# EasyEDA Pro project 同轴电缆.eprj, schematic 模拟部分

## Sheets
1 定向电桥: Create Date: 2023-09-01; Page Name: 定向电桥; Project Name: 同轴线缆长度及终端负载检测装置; Schematic Name: 模拟部分; Update Date: 2023-09-01; Company: 嘉立创EDA; Page Size: A4; Version: V1.0
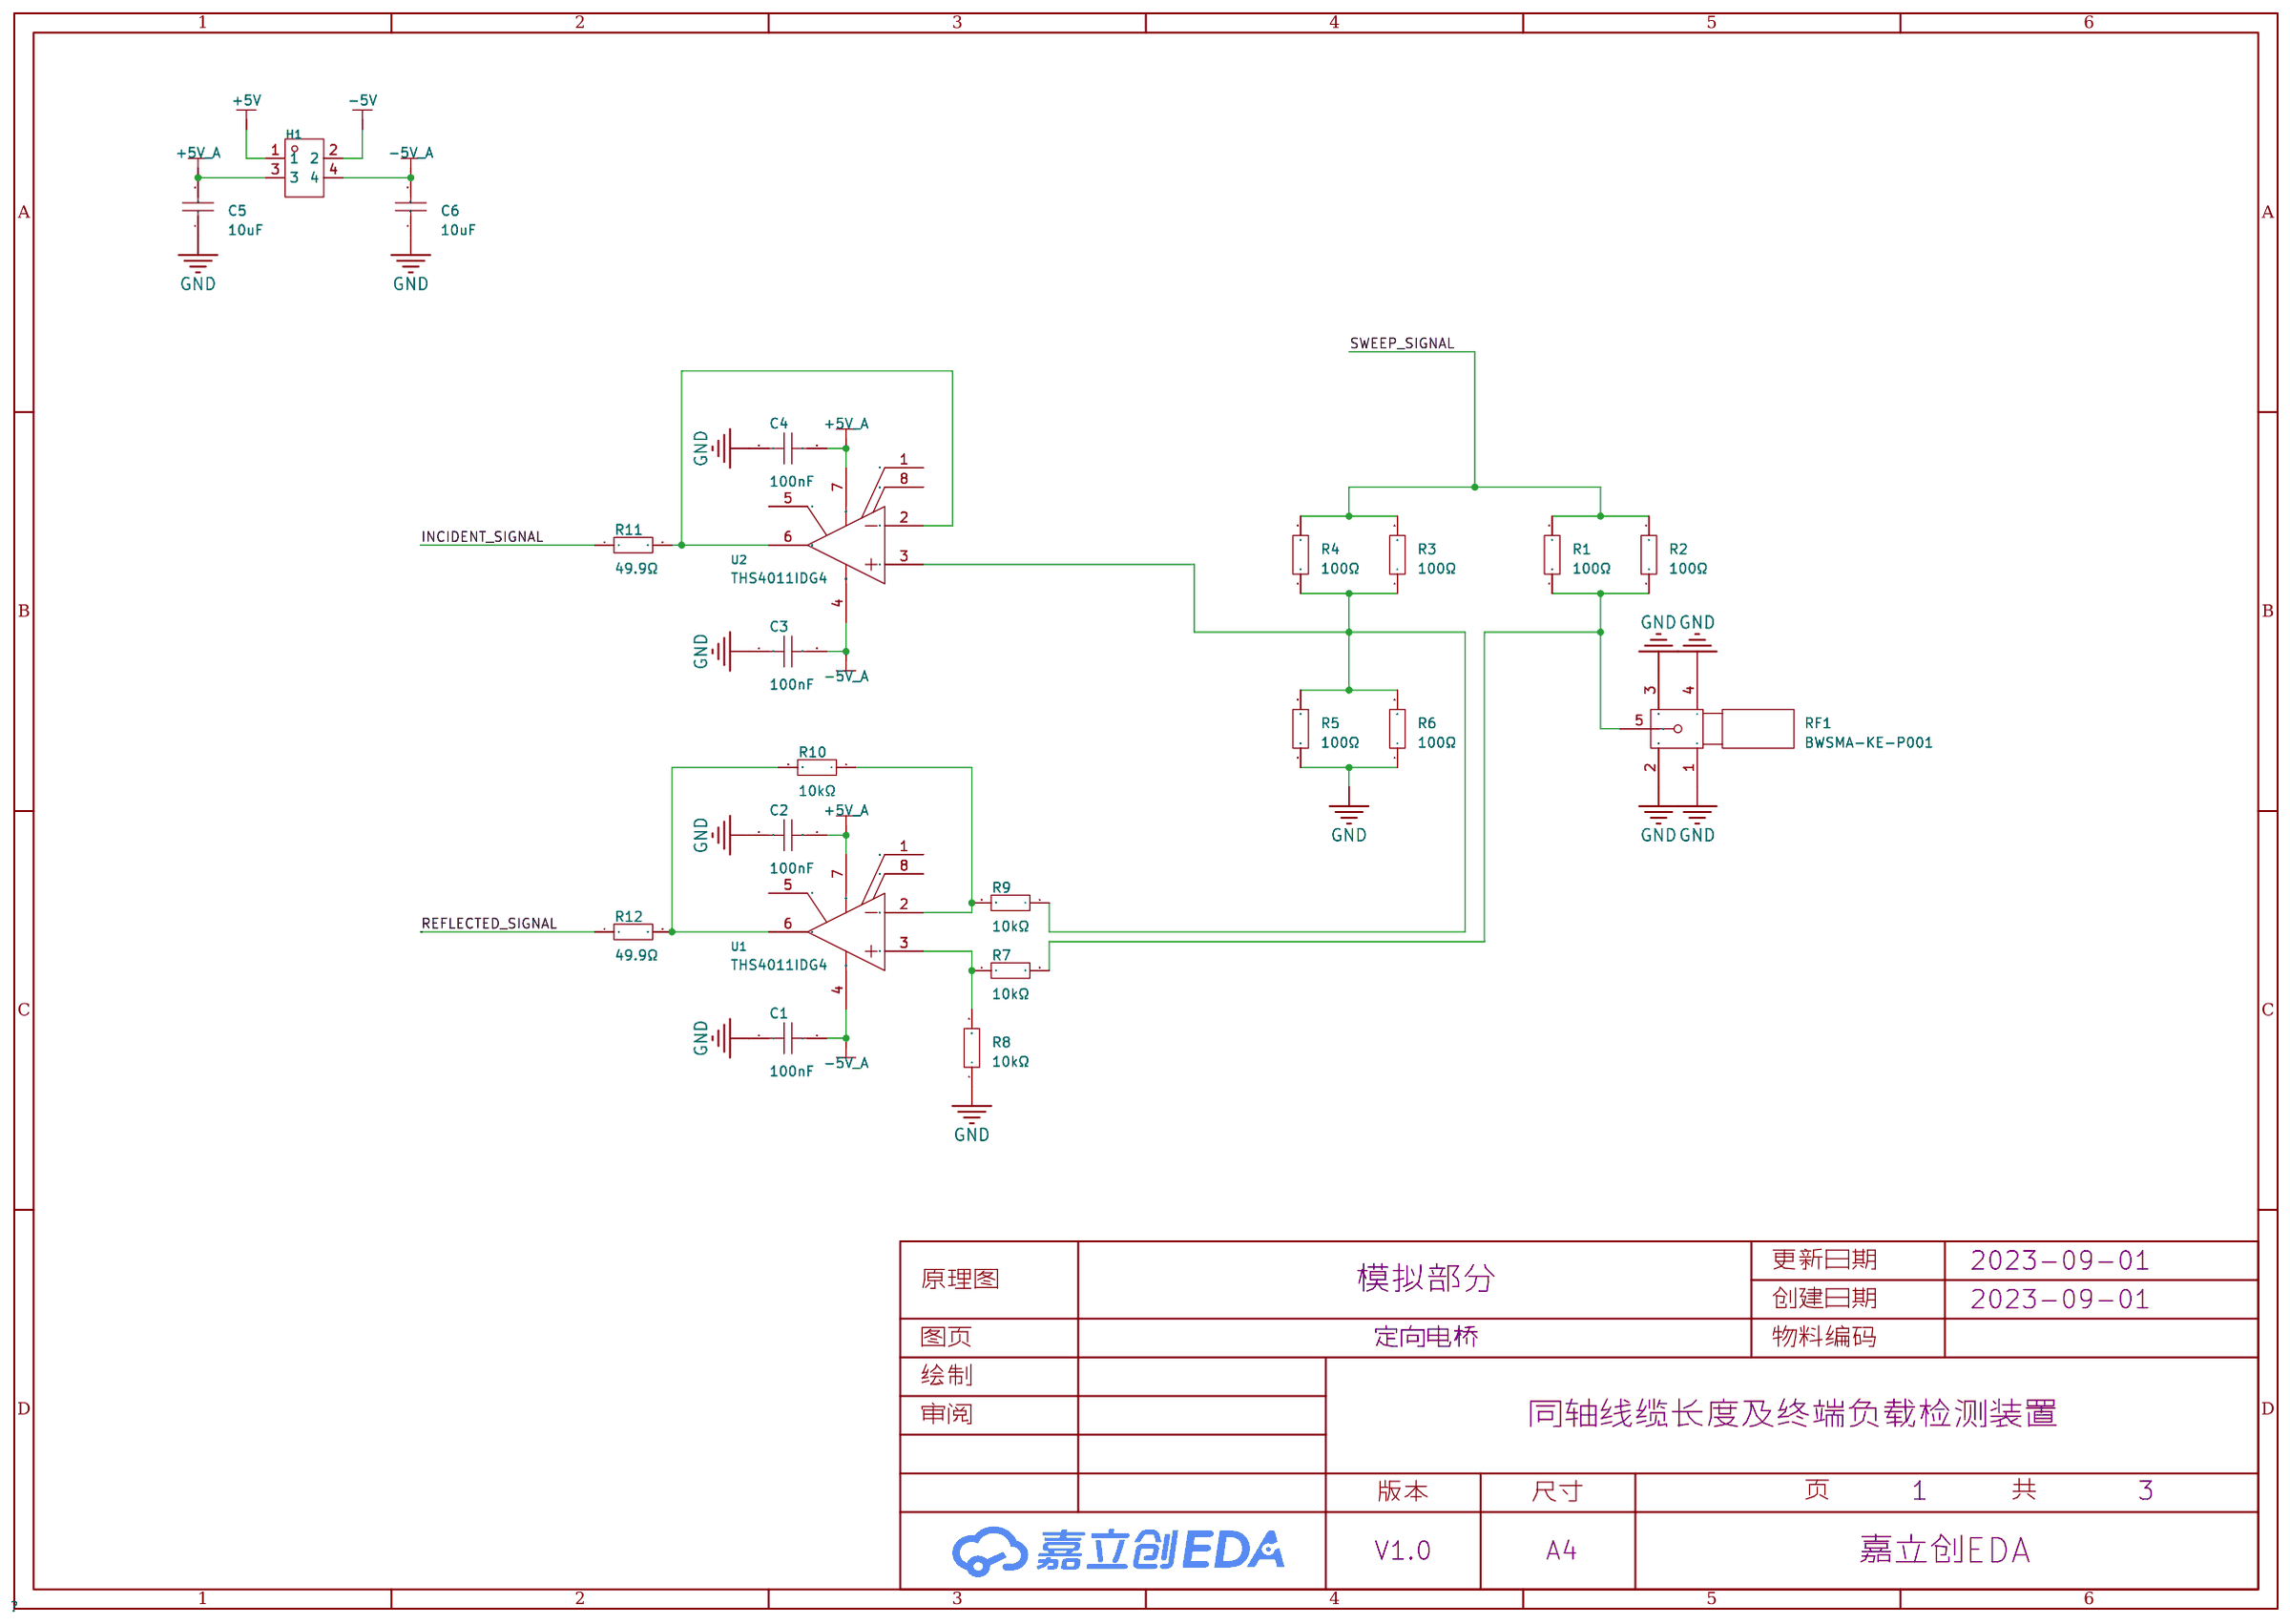
[diagram p0: 定向电桥]
2 混频器: Page Name: 混频器; Project Name: 【2023电赛本科组-TI杯】同轴线缆长度及终端负载检测装置; Update Date: 2023-09-07
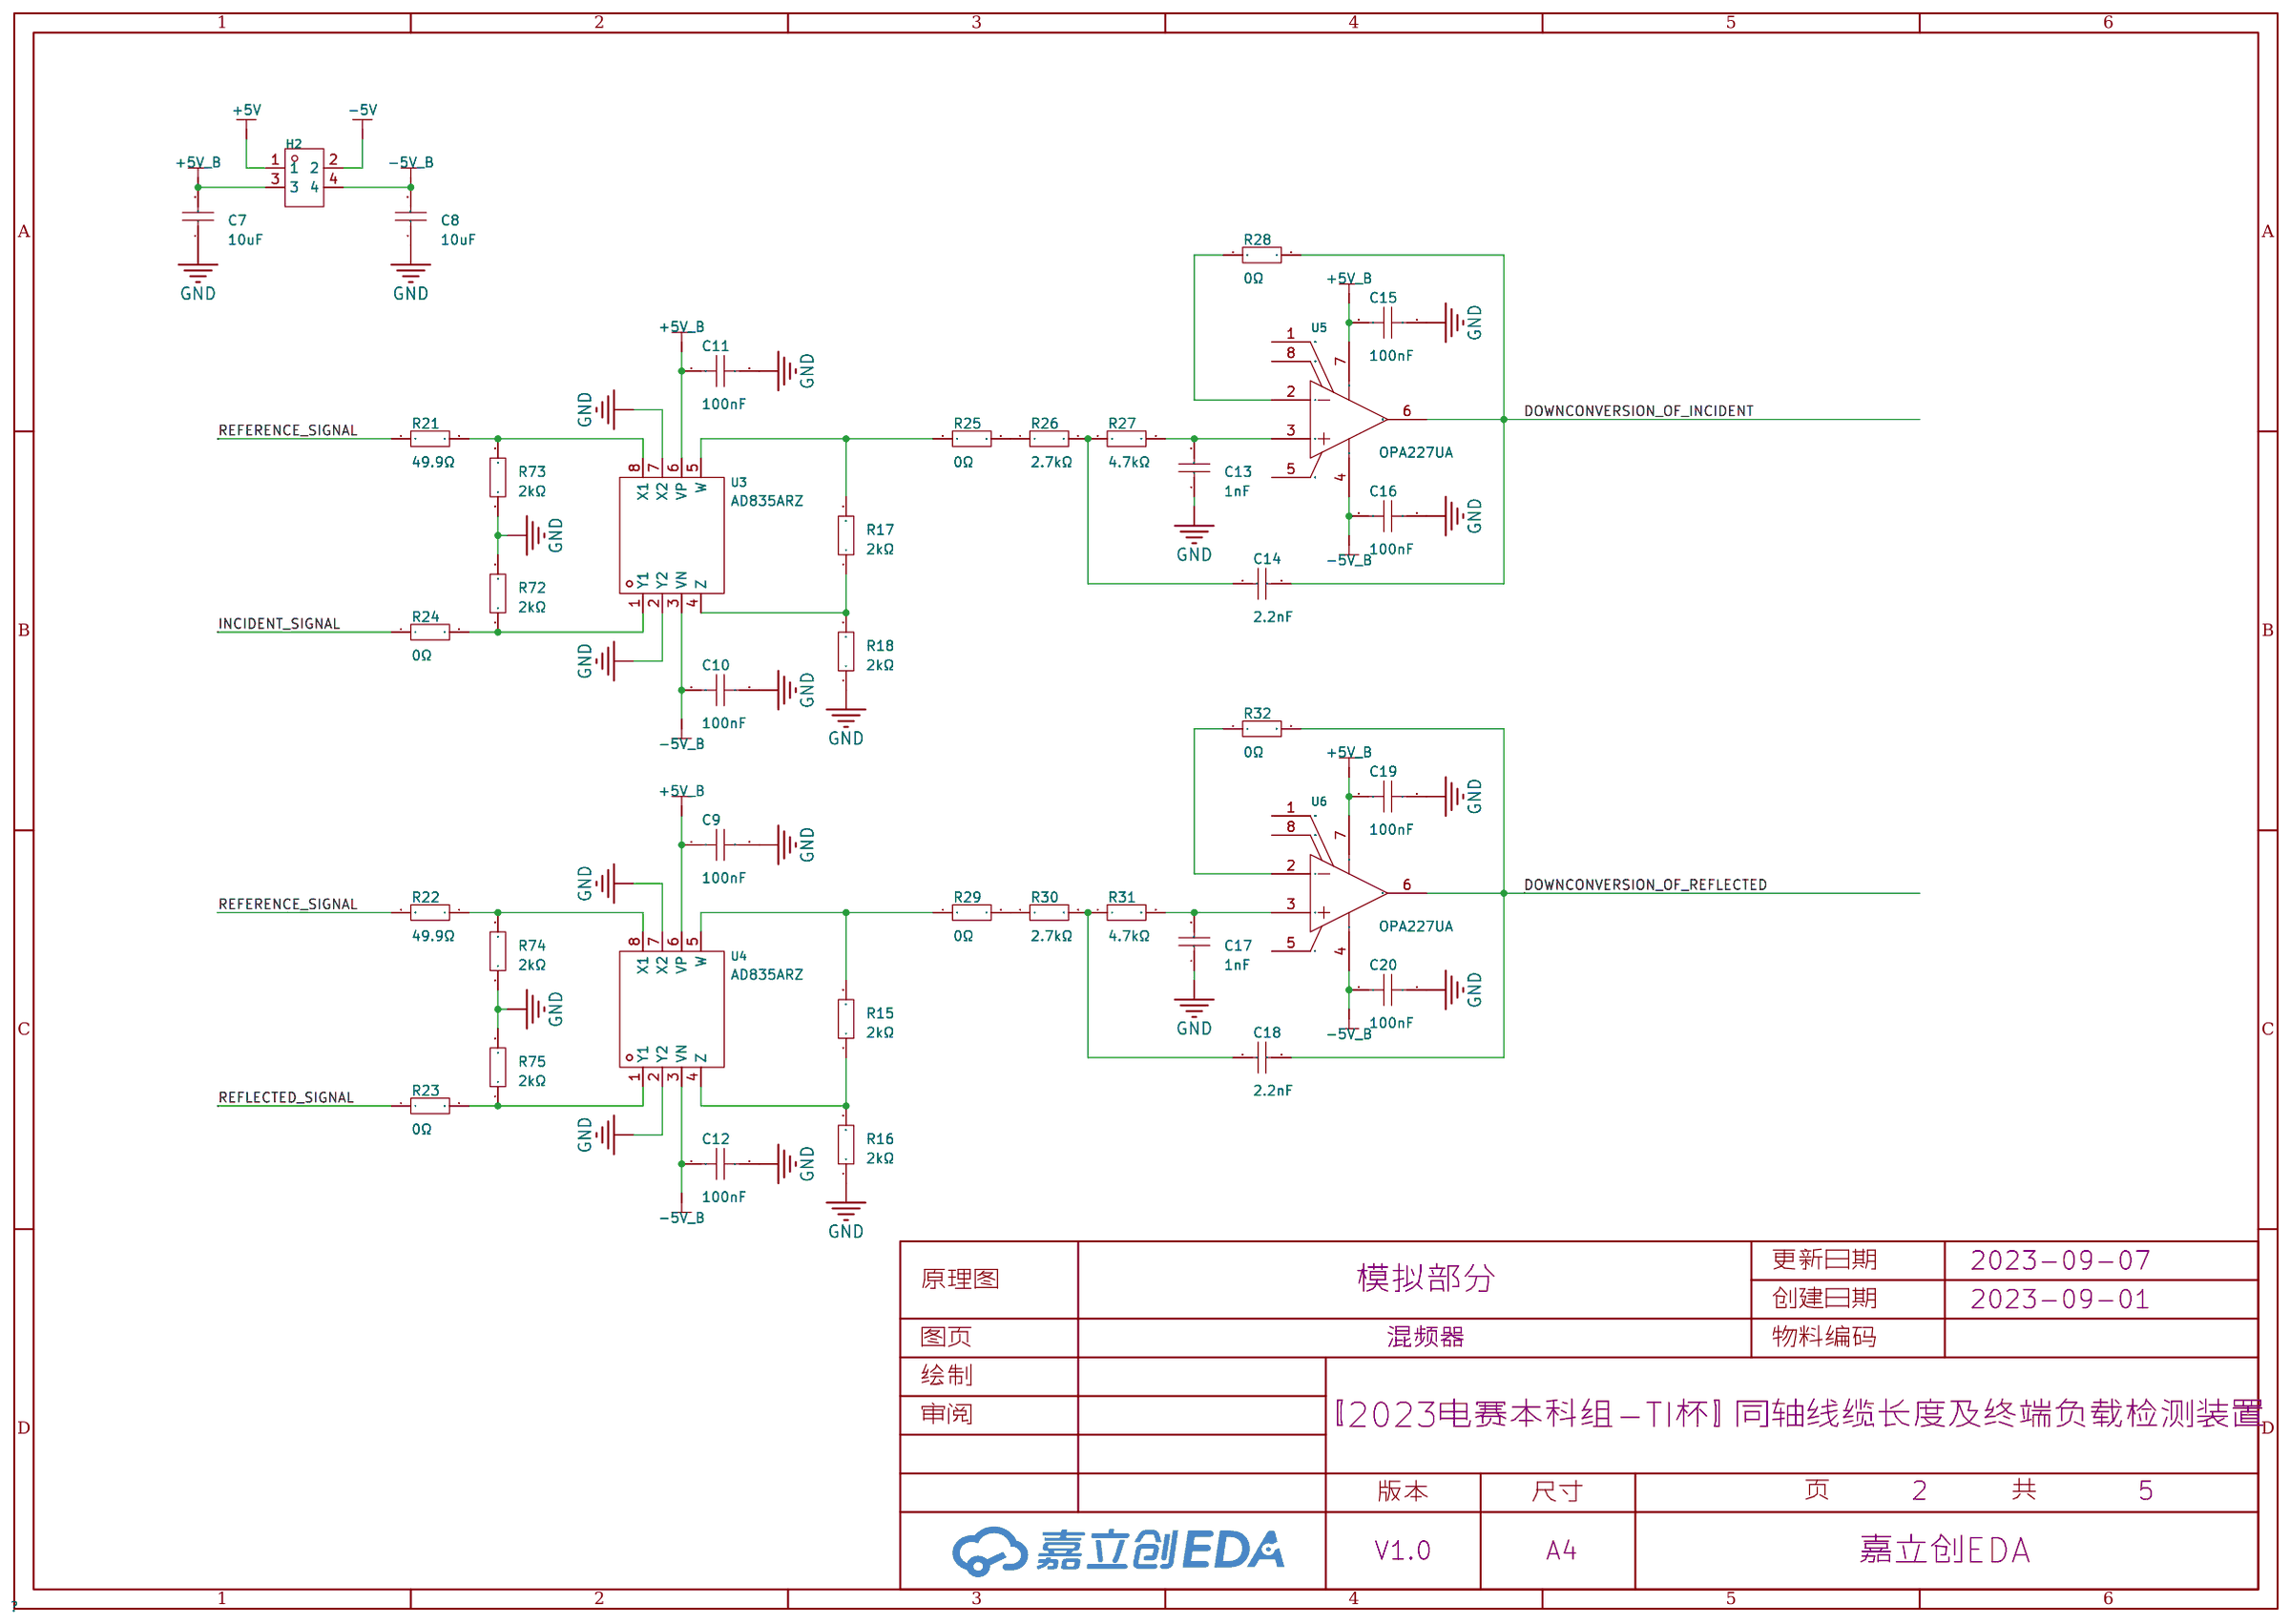
[diagram p1: 混频器]
3 ADC: Page Name: ADC; Update Date: 2023-09-02
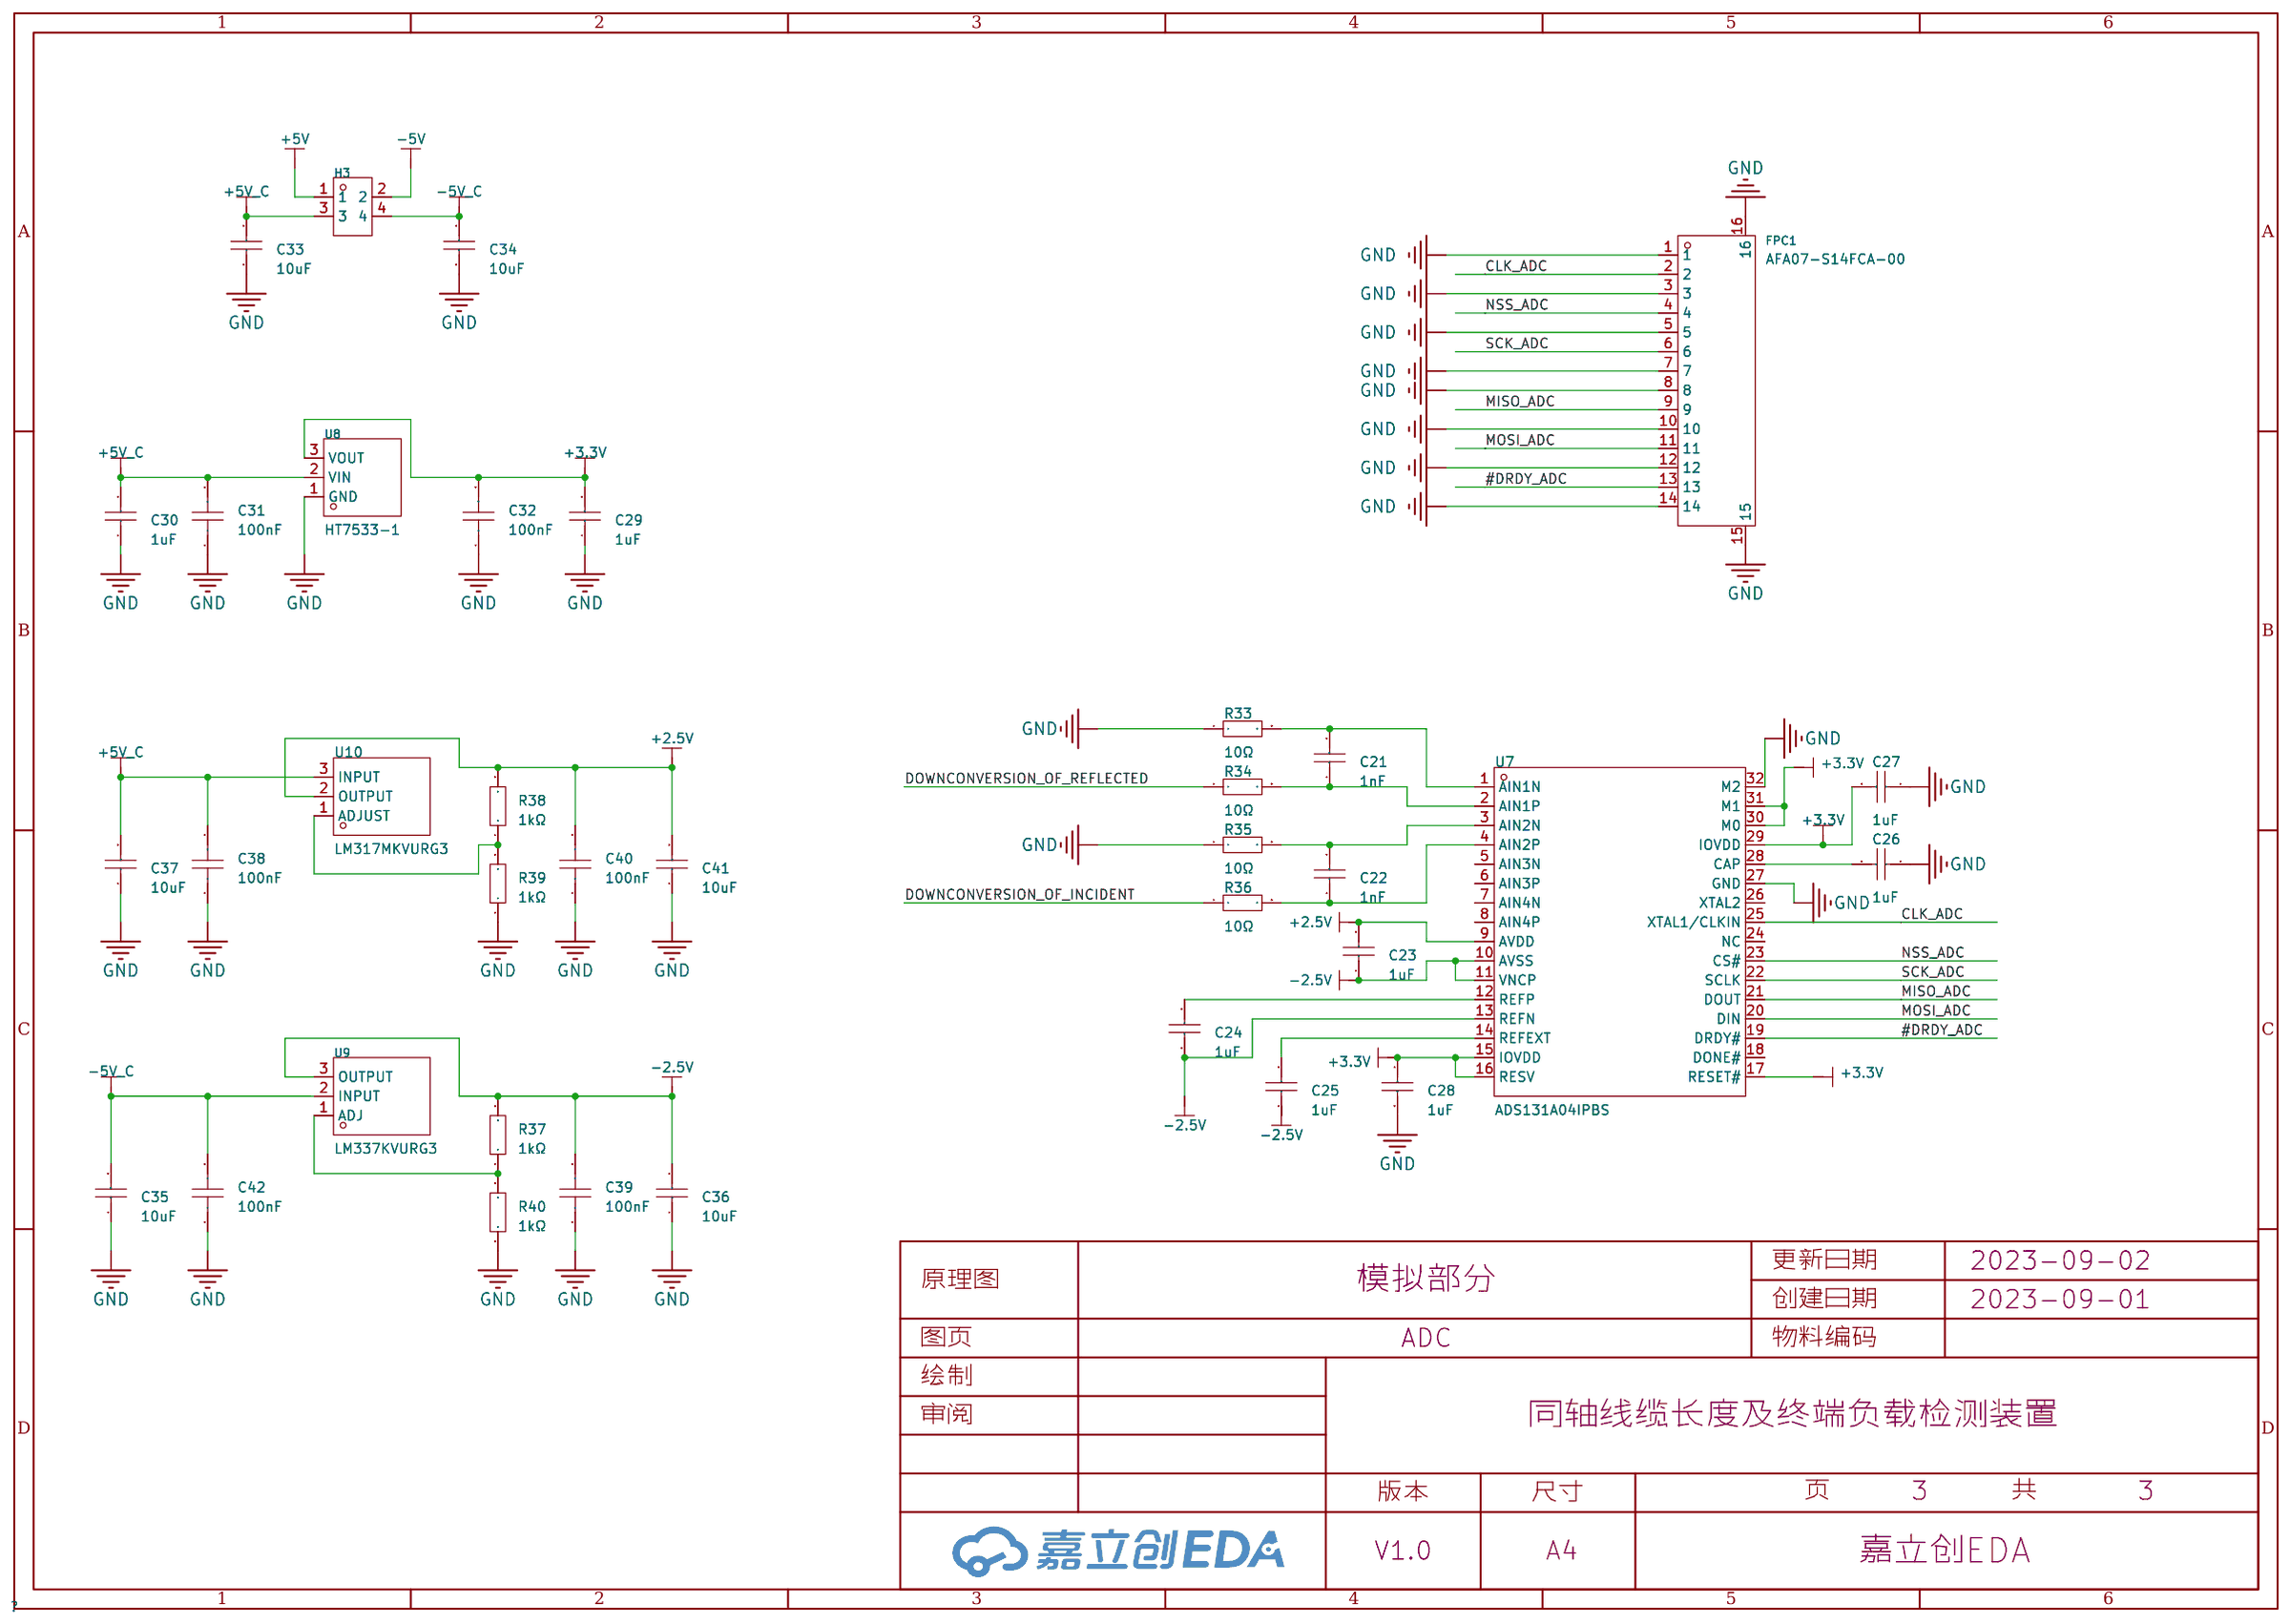
[diagram p2: ADC]
4 DDS: Create Date: 2023-09-02; Page Name: DDS; Project Name: 【2023电赛本科组-TI杯】同轴线缆长度及终端负载检测装置; Update Date: 2023-09-25
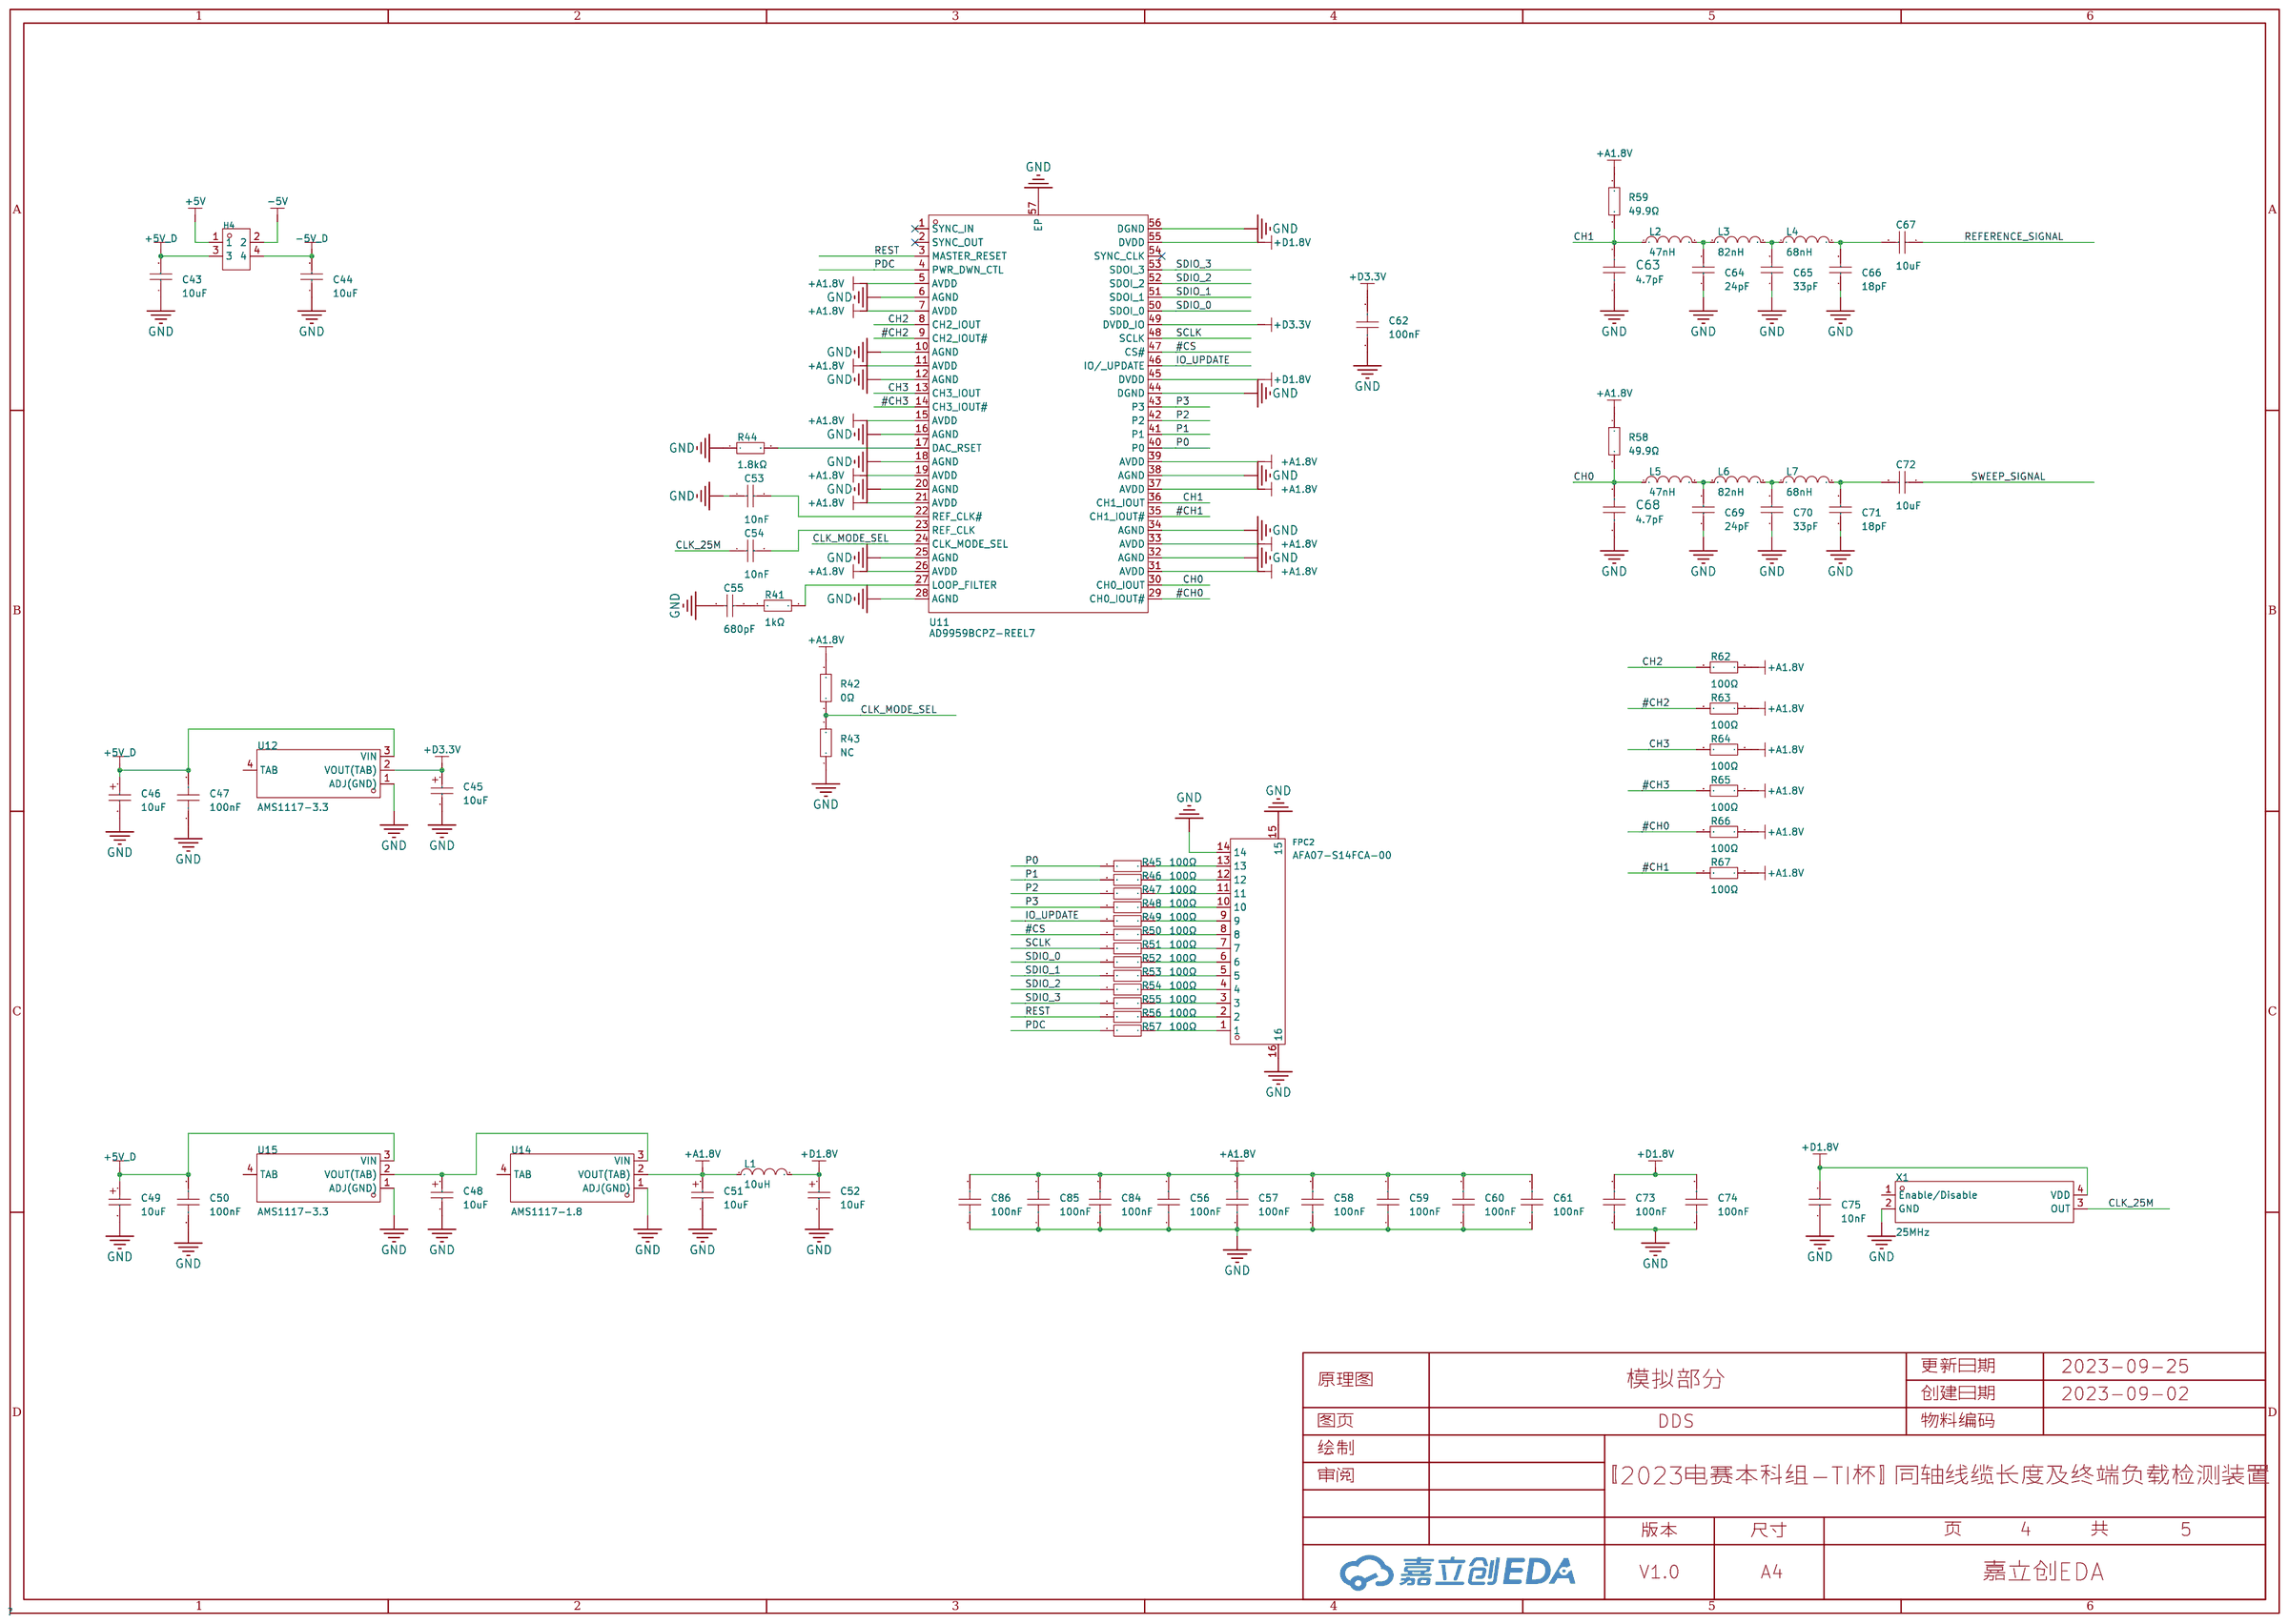
[diagram p3: DDS]
5 电源电路: Create Date: 2023-09-02; Page Name: 电源电路; Update Date: 2023-09-02
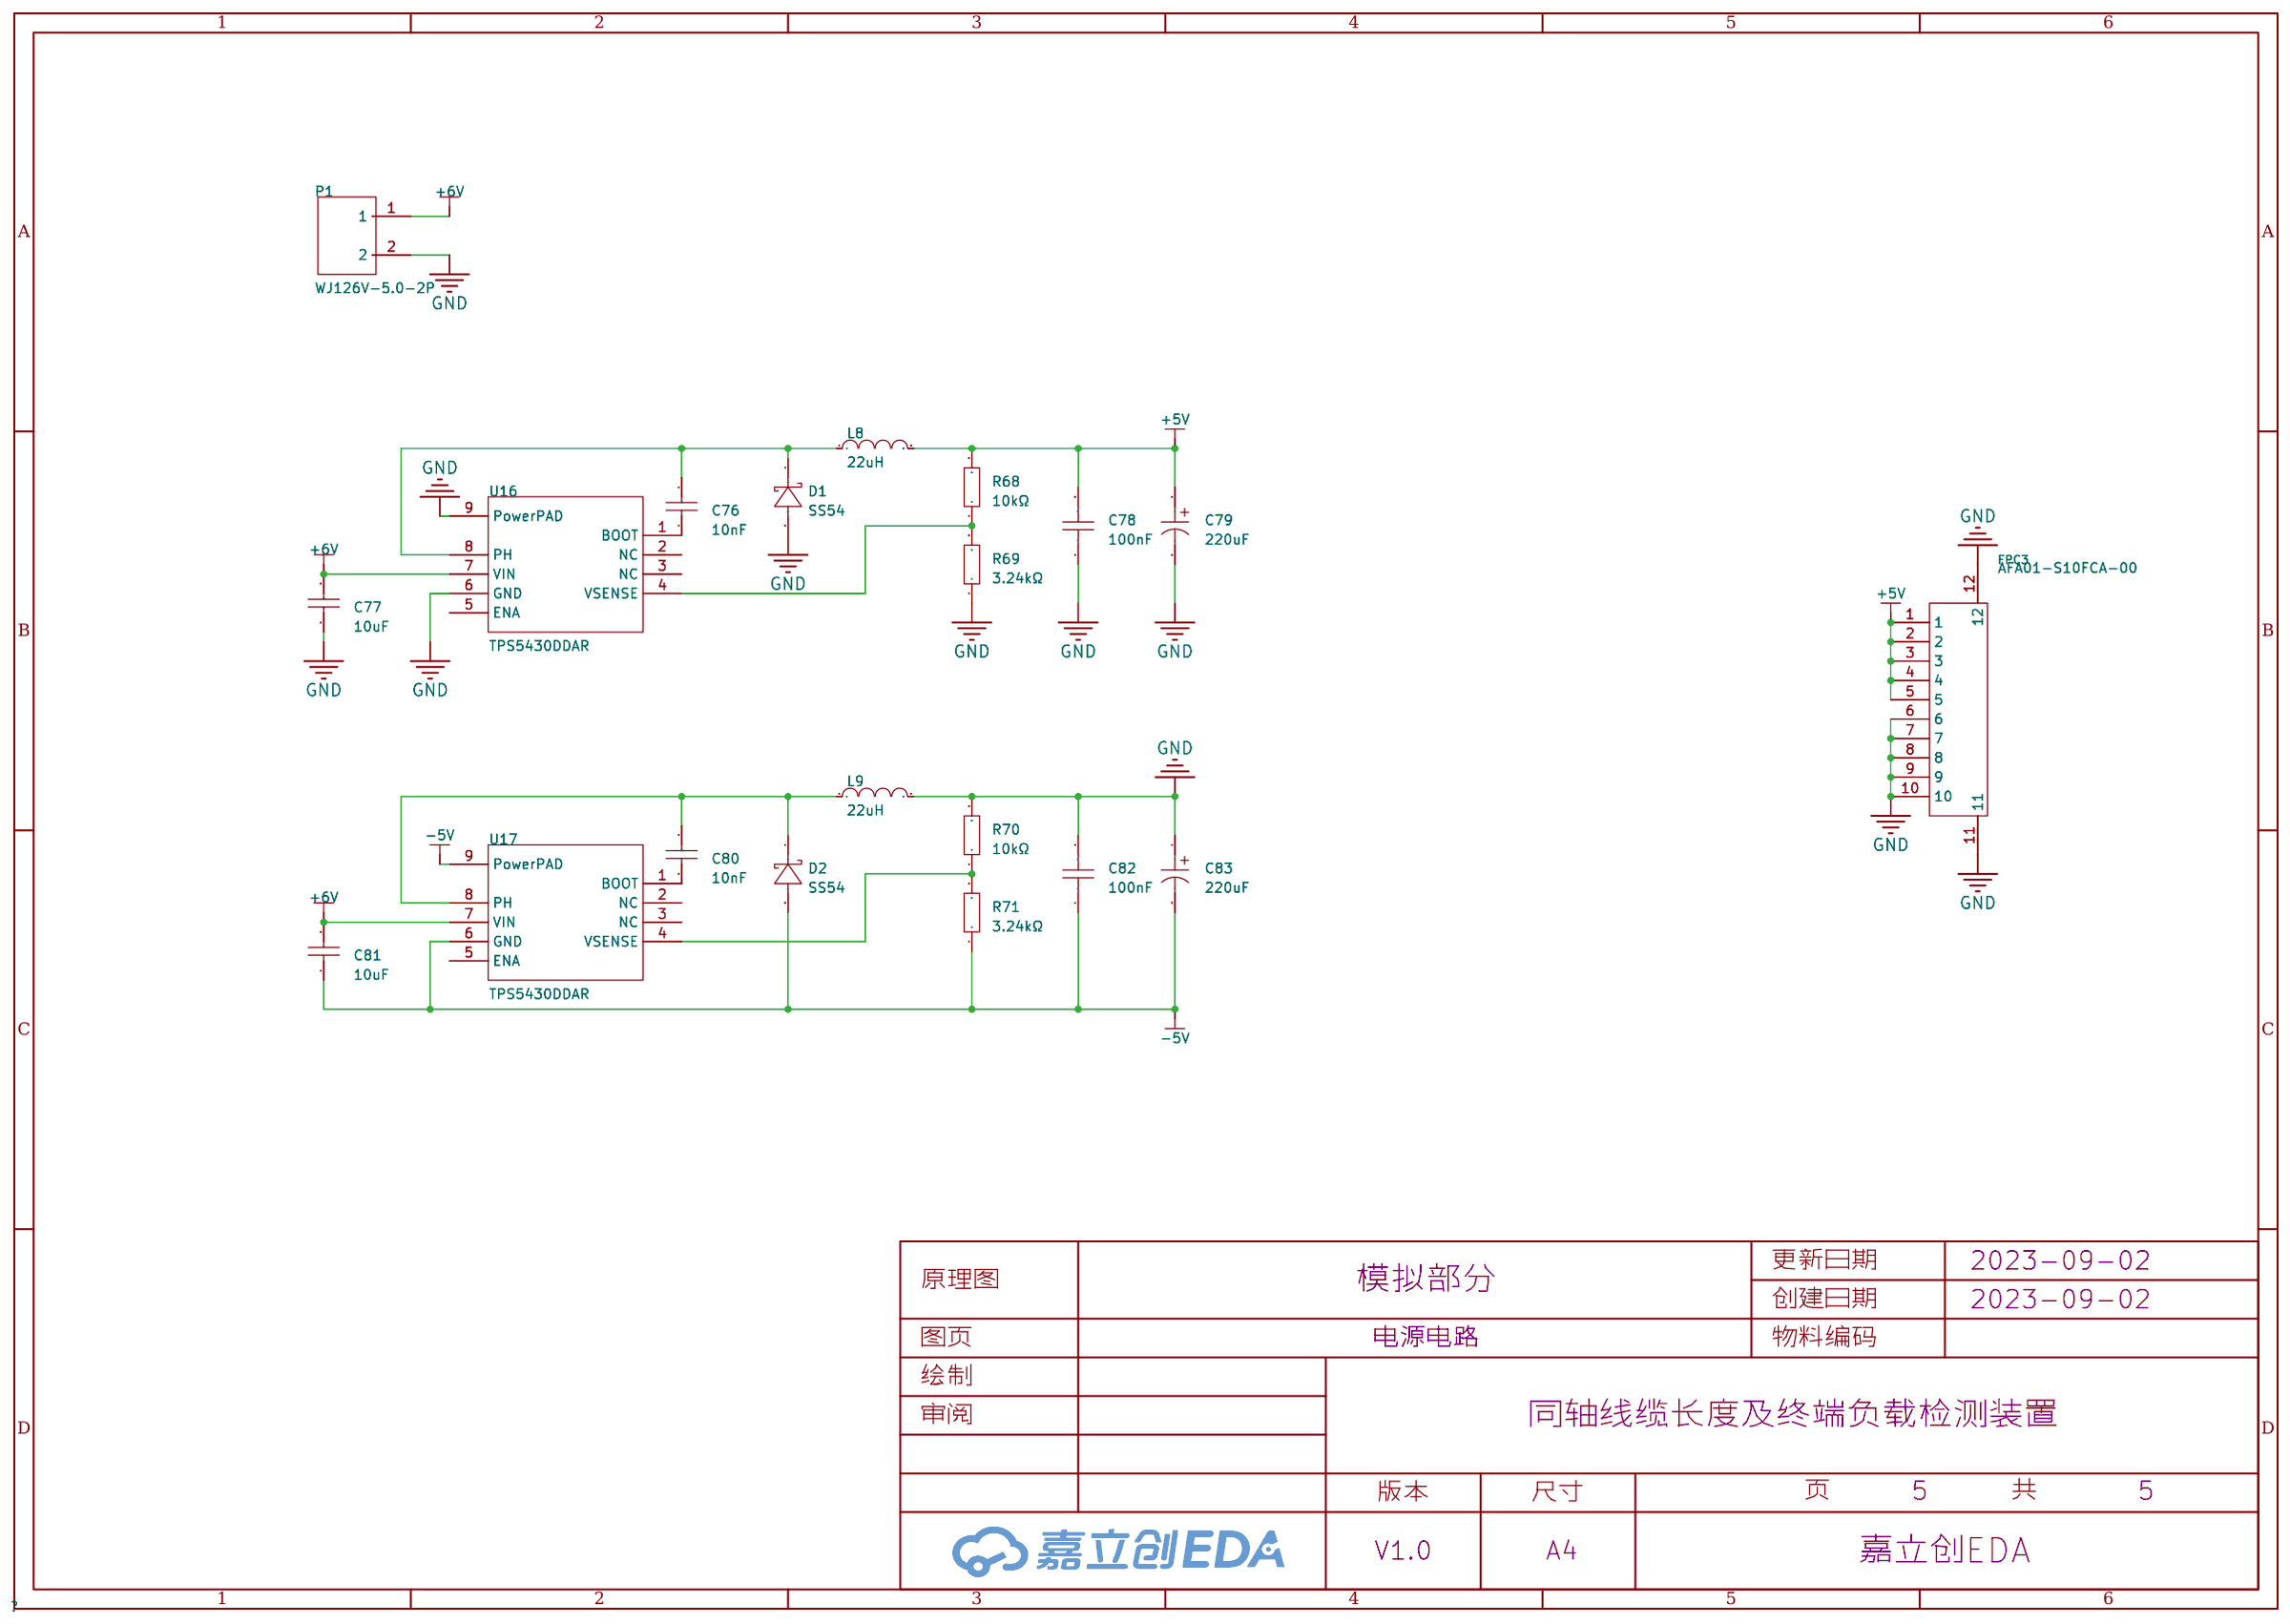
[diagram p4: 电源电路]

## Parts
sheet ADC
C21  1nF  [C0603]
C22  1nF  [C0603]
C23  1uF  [C0603]
C24  1uF  [C0603]
C25  1uF  [C0603]
C26  1uF  [C0603]
C27  1uF  [C0603]
C28  1uF  [C0603]
C29  1uF  [C0603]
C30  1uF  [C0603]
C31  100nF  [C0603]
C32  100nF  [C0603]
C33  10uF  [C0805]
C34  10uF  [C0805]
C35  10uF  [C0805]
C36  10uF  [C0805]
C37  10uF  [C0805]
C38  100nF  [C0603]
C39  100nF  [C0603]
C40  100nF  [C0603]
C41  10uF  [C0805]
C42  100nF  [C0603]
FPC1  AFA07-S14FCA-00  [FPC-SMD_P1.00-14P_LCS-XJ-H2.5]
H3  PZ254V-12-4P  [HDR-TH_4P-P2.54-V-M-R2-C2-S2.54]
R33  10Ω  [R0603]
R34  10Ω  [R0603]
R35  10Ω  [R0603]
R36  10Ω  [R0603]
R37  1kΩ  [R0603]
R38  1kΩ  [R0603]
R39  1kΩ  [R0603]
R40  1kΩ  [R0603]
U7  ADS131A04IPBS  [TQFP-32_L5.0-W5.0-P0.50-LS7.0-BL]
U8  HT7533-1  [SOT-89_L4.5-W2.5-P1.50-LS4.2-BR]
U9  LM337KVURG3  [DPAK-3_L6.6-W6.1-P2.28-LS9.9-BR]
U10  LM317MKVURG3  [TO-252-3_L6.5-W6.1-P4.58-TL]
sheet DDS
C43  10uF  [C0805]
C44  10uF  [C0805]
C45  10uF  [CAP-SMD_L3.2-W1.6-RD-C7171]
C46  10uF  [CAP-SMD_L3.2-W1.6-RD-C7171]
C47  100nF  [C0603]
C48  10uF  [CAP-SMD_L3.2-W1.6-RD-C7171]
C49  10uF  [CAP-SMD_L3.2-W1.6-RD-C7171]
C50  100nF  [C0603]
C51  10uF  [CAP-SMD_L3.2-W1.6-RD-C7171]
C52  10uF  [CAP-SMD_L3.2-W1.6-RD-C7171]
C53  10nF  [C0603]
C54  10nF  [C0603]
C55  680pF  [C0603]
C56  100nF  [C0603]
C57  100nF  [C0603]
C58  100nF  [C0603]
C59  100nF  [C0603]
C60  100nF  [C0603]
C61  100nF  [C0603]
C62  100nF  [C0603]
C63  4.7pF  [C0603]
C64  24pF  [C0603]
C65  33pF  [C0603]
C66  18pF  [C0603]
C67  10uF  [C0805]
C68  4.7pF  [C0603]
C69  24pF  [C0603]
C70  33pF  [C0603]
C71  18pF  [C0603]
C72  10uF  [C0805]
C73  100nF  [C0603]
C74  100nF  [C0603]
C75  10nF  [C0603]
C84  100nF  [C0603]
C85  100nF  [C0603]
C86  100nF  [C0603]
FPC2  AFA07-S14FCA-00  [FPC-SMD_P1.00-14P_LCS-XJ-H2.5]
H4  PZ254V-12-4P  [HDR-TH_4P-P2.54-V-M-R2-C2-S2.54]
L1  10uH  [L1210]
L2  47nH  [L0603]
L3  82nH  [L0603]
L4  68nH  [L0603]
L5  47nH  [L0603]
L6  82nH  [L0603]
L7  68nH  [L0603]
R41  1kΩ  [R0603]
R42  0Ω  [R0603]
R43  NC  [R0603]
R44  1.8kΩ  [R0603]
R45  100Ω  [R0603]
R46  100Ω  [R0603]
R47  100Ω  [R0603]
R48  100Ω  [R0603]
R49  100Ω  [R0603]
R50  100Ω  [R0603]
R51  100Ω  [R0603]
R52  100Ω  [R0603]
R53  100Ω  [R0603]
R54  100Ω  [R0603]
R55  100Ω  [R0603]
R56  100Ω  [R0603]
R57  100Ω  [R0603]
R58  49.9Ω  [R0603]
R59  49.9Ω  [R0603]
R62  100Ω  [R0603]
R63  100Ω  [R0603]
R64  100Ω  [R0603]
R65  100Ω  [R0603]
R66  100Ω  [R0603]
R67  100Ω  [R0603]
U11  AD9959BCPZ-REEL7  [LFCSP-56_L8.0-W8.0-P0.50-BL-EP]
U12  AMS1117-3.3  [SOT-223-4_L6.5-W3.5-P2.30-LS7.0-BR]
U14  AMS1117-1.8  [SOT-223_L6.7-W3.5-P2.30-BR]
U15  AMS1117-3.3  [SOT-223-4_L6.5-W3.5-P2.30-LS7.0-BR]
X1  25MHz  [OSC-SMD_4P-L3.2-W2.5-BL]
sheet 定向电桥
C1  100nF  [C0603]
C2  100nF  [C0603]
C3  100nF  [C0603]
C4  100nF  [C0603]
C5  10uF  [C0805]
C6  10uF  [C0805]
H1  PZ254V-12-4P  [HDR-TH_4P-P2.54-V-M-R2-C2-S2.54]
R1  100Ω  [R0603]
R2  100Ω  [R0603]
R3  100Ω  [R0603]
R4  100Ω  [R0603]
R5  100Ω  [R0603]
R6  100Ω  [R0603]
R7  10kΩ  [R0603]
R8  10kΩ  [R0603]
R9  10kΩ  [R0603]
R10  10kΩ  [R0603]
R11  49.9Ω  [R0603]
R12  49.9Ω  [R0603]
RF1  BWSMA-KE-P001  [SMA-SMD_BWSMA-KE-P001]
U1  THS4011IDG4  [SOIC-8_L4.9-W3.9-P1.27-LS6.0-BL]
U2  THS4011IDG4  [SOIC-8_L4.9-W3.9-P1.27-LS6.0-BL]
sheet 混频器
C7  10uF  [C0805]
C8  10uF  [C0805]
C9  100nF  [C0603]
C10  100nF  [C0603]
C11  100nF  [C0603]
C12  100nF  [C0603]
C13  1nF  [C0603]
C14  2.2nF  [C0603]
C15  100nF  [C0603]
C16  100nF  [C0603]
C17  1nF  [C0603]
C18  2.2nF  [C0603]
C19  100nF  [C0603]
C20  100nF  [C0603]
H2  PZ254V-12-4P  [HDR-TH_4P-P2.54-V-M-R2-C2-S2.54]
R15  2kΩ  [R0603]
R16  2kΩ  [R0603]
R17  2kΩ  [R0603]
R18  2kΩ  [R0603]
R21  49.9Ω  [R0603]
R22  49.9Ω  [R0603]
R23  0Ω  [R0603]
R24  0Ω  [R0603]
R25  0Ω  [R0603]
R26  2.7kΩ  [R0603]
R27  4.7kΩ  [R0603]
R28  0Ω  [R0603]
R29  0Ω  [R0603]
R30  2.7kΩ  [R0603]
R31  4.7kΩ  [R0603]
R32  0Ω  [R0603]
R72  2kΩ  [R0603]
R73  2kΩ  [R0603]
R74  2kΩ  [R0603]
R75  2kΩ  [R0603]
U3  AD835ARZ  [SOIC-8_L4.9-W3.9-P1.27-LS6.0-TL]
U4  AD835ARZ  [SOIC-8_L4.9-W3.9-P1.27-LS6.0-TL]
U5  OPA227UA  [SOIC-8_L4.9-W3.9-P1.27-LS6.0-BL]
U6  OPA227UA  [SOIC-8_L4.9-W3.9-P1.27-LS6.0-BL]
sheet 电源电路
C76  10nF  [C0603]
C77  10uF  [C0805]
C78  100nF  [C0603]
C79  220uF  [CAP-TH_BD6.3-P2.50-D0.6-FD-1]
C80  10nF  [C0603]
C81  10uF  [C0805]
C82  100nF  [C0603]
C83  220uF  [CAP-TH_BD6.3-P2.50-D0.6-FD-1]
D1  SS54  [SMA_L4.3-W2.6-LS5.0-RD]
D2  SS54  [SMA_L4.3-W2.6-LS5.0-RD]
FPC3  AFA01-S10FCA-00  [FPC-SMD_10P-P1.0_FGS-XJ-H2.0]
L8  22uH  [IND-SMD_L7.1-W6.6_SLO0618H]
L9  22uH  [IND-SMD_L7.1-W6.6_SLO0618H]
P1  WJ126V-5.0-2P  [CONN-TH_WJ126V-5.0-2P]
R68  10kΩ  [R0603]
R69  3.24kΩ  [R0603]
R70  10kΩ  [R0603]
R71  3.24kΩ  [R0603]
U16  TPS5430DDAR  [ESOP-8_L4.9-W3.9-P1.27-LS6.0-TL-EP]
U17  TPS5430DDAR  [ESOP-8_L4.9-W3.9-P1.27-LS6.0-TL-EP]

## Library data of the parts
C13 C17 C21 C22 = CC0603KRX7R9BB102: 容值:1nF;精度:±10%;额定电压:50V;材质(温度系数):X7R;; LCSC Part Name: 1nF ±10% 50V; Supplier Part: C100040; Manufacturer: YAGEO(国巨); Supplier Footprint: 0603; JLCPCB Part Class: 扩展库; Datasheet: https://atta.szlcsc.com/upload/public/pdf/source/20170420/1492670664651.pdf; Supplier: LCSC; Tolerance: ±10%; Voltage Rated: 50V; Temperature Coefficient: X7R
C23-C30 = CC0603KRX5R8BB105: 容值:1uF;精度:±10%;额定电压:25V;材质(温度系数):X5R;; LCSC Part Name: 1uF ±10% 25V; Supplier Part: C14664; Manufacturer: YAGEO(国巨); Supplier Footprint: 0603; JLCPCB Part Class: 扩展库; Datasheet: https://atta.szlcsc.com/upload/public/pdf/source/20160606/1465200209684.pdf; Supplier: LCSC; Tolerance: ±10%; Voltage Rated: 25V; Temperature Coefficient: X5R
C1-C4 C9-C12 C15 C16 C19 C20 C31 C32 C38-C40 C42 C47 C50 C56-C62 C73 C74 C78 C82 C84-C86 = CC0603KRX7R9BB104: 容值:100nF;精度:±10%;额定电压:50V;材质(温度系数):X7R;; LCSC Part Name: 100nF ±10% 50V; Supplier Part: C14663; Manufacturer: YAGEO(国巨); Supplier Footprint: 0603; Datasheet: https://atta.szlcsc.com/upload/public/pdf/source/20180910/C282072_33301C7F631E79921B82A8DAC6BCC5B3.pdf; Supplier: LCSC; Tolerance: ±10%; Voltage Rated: 50V; Temperature Coefficient: X7R
C5-C8 C33-C37 C41 C43 C44 C67 C72 C77 C81 = CC0805KKX5R8BB106_C89831: 容值:10uF;精度:±10%;额定电压:25V;材质(温度系数):X5R;; LCSC Part Name: 10uF ±10% 25V; Supplier Part: C89831; Manufacturer: YAGEO(国巨); Manufacturer Part: CC0805KKX5R8BB106; Supplier Footprint: 0805; Datasheet: https://atta.szlcsc.com/upload/public/pdf/source/20170424/1493023836811.pdf; Supplier: LCSC; Tolerance: ±10%; Voltage Rated: 25V; Temperature Coefficient: X5R
FPC1 FPC2 = AFA07-S14FCA-00: 间距:1mm;触点数量:14P;锁定特性:抽屉式;安装类型:卧贴;触点类型:下接;; LCSC Part Name: 1mm P数:14P 抽屉式 下接; Supplier Part: C262720; Manufacturer: JS(钜硕电子); Supplier Footprint: SMD,P=1mm; JLCPCB Part Class: 扩展库; Datasheet: https://atta.szlcsc.com/upload/public/pdf/source/20191217/C262716_30B15E9A77BFCA4A54741C92DB3BE8CC.pdf; Supplier: LCSC; Pitch: 1mm; Number of Contacts: 14P; Locking Feature: 抽屉式; Mounting Type: 卧贴; Contact Type: 下接; Height Above Board: 2.5mm; FFC, FCB Thickness: 0.3mm
H1-H4 = PZ254V-12-4P: 排数:双排;总PIN位数:4;间距:2.54mm;插针结构:2x2P;行距:2.54mm;安装类型:直插;圆针/方针:方针;额定电流:-;额定电压:-;配合针长度:6mm;塑高:2.5mm;端接针长度:3mm;触头材质:黄铜;触头镀层:-;工作温度范围:-40℃~+105℃;颜色:黑色;; LCSC Part Name: 2.54mm 2x2P 直插 方针; Supplier Part: C492419; Manufacturer: XFCN(兴飞); Supplier Footprint: 直插,P=2.54mm; Supplier: LCSC; Number of Rows: 双排; Number of Pins: 4; Pitch: 2.54mm; Pin Structure: 2x2P; Row Spacing: 2.54mm; Mounting Type: 直插; Circluar Pins/Square Pins: 方针; Length of Mating Pin: 6mm; Insulation Height: 2.5mm; Length of End Connection Pin: 3mm; Contact Material: 黄铜; Operating Temperature Range: -40℃~+105℃; Color: 黑色
R33-R36 = 0603WAF100JT5E: 电阻类型:厚膜电阻;阻值:10Ω;精度:±1%;功率:100mW;; LCSC Part Name: 10Ω ±1% 100mW; Supplier Part: C22859; Manufacturer: UNI-ROYAL(厚声); Supplier Footprint: 0603; JLCPCB Part Class: 基础库; Datasheet: https://atta.szlcsc.com/upload/public/pdf/source/20200306/C422600_1E6D84923E4A46A82E41ADD87F860B5C.pdf; Supplier: LCSC; Type: 厚膜电阻; Tolerance: ±1%; Power(Watts): 100mW; Temperature Coefficient: ±400ppm/℃; Overload Voltage (Max): 75V; Operating Temperature Range: -55℃~+155℃
R37-R40 = RT0603BRD071KL: 电阻类型:薄膜电阻;阻值:1kΩ;精度:±0.1%;功率:100mW;; LCSC Part Name: 1kΩ ±0.1% 100mW; Supplier Part: C110776; Manufacturer: YAGEO(国巨); Supplier Footprint: 0603; JLCPCB Part Class: 扩展库; Datasheet: https://atta.szlcsc.com/upload/public/pdf/source/20170704/1499151282044.pdf; Supplier: LCSC; Type: 薄膜电阻; Tolerance: ±0.1%; Power(Watts): 100mW; Temperature Coefficient: ±25ppm/℃; Overload Voltage (Max): 75V; Operating Temperature Range: -55℃~+155℃
U7 = ADS131A04IPBS: 24 位 128kSPS 4 通道同步采样 Δ-Σ ADC 32-TQFP -40 to 125; Supplier Part: C2861481; Manufacturer: TI(德州仪器); Supplier Footprint: TQFP-32(5x5); JLCPCB Part Class: 扩展库; Datasheet: https://atta.szlcsc.com/upload/public/pdf/source/20230221/80AFE80BED057D508D132B97E45EDD9A.pdf; Supplier: LCSC
U8 = HT7533-1_C347186: 输出类型:固定;输出极性:正;最大输入电压:30V;输出电压:3.3V;输出电流:100mA;电源纹波抑制比(PSRR):-;; LCSC Part Name: 输入30V 输出3.3V 100mA; Supplier Part: C347186; Manufacturer: UMW(友台半导体); Supplier Footprint: SOT-89; JLCPCB Part Class: 扩展库; Datasheet: https://atta.szlcsc.com/upload/public/pdf/source/20211011/14A8885EF2D0EAB6F7EFBBA9AB63A157.pdf; Supplier: LCSC; Output Type: 固定; Output Polarity: 正; Number of Outputs: 1; Maximum Input Voltage: 30V; Output Voltage: 3.3V; Dropout Voltage: 100mV@(1mA); Quiescent Current (Ground Current): 3uA; Output Current: 100mA; Operating Temperature: -25℃~+70℃
U9 = LM337KVURG3: 输出类型:可调;输出极性:负;最大输入电压:40V;输出电压:1.2V~37V;输出电流:1.5A;电源纹波抑制比(PSRR):77dB@(120Hz);; Supplier Part: C2871286; Manufacturer: TI(德州仪器); Supplier Footprint: TO-252; JLCPCB Part Class: 扩展库; Datasheet: https://www.ti.com/cn/lit/gpn/lm337; Supplier: LCSC; Output Type: 可调; Output Polarity: 负; Number of Outputs: 1; Maximum Input Voltage: 40V; Output Voltage: 1.2V~37V; Output Current: 1.5A; Power Supply Rejection Ratio (PSRR): 77dB@(120Hz); Operating Temperature: 0℃~+125℃
U10 = LM317MKVURG3: 3 端子、500mA 可调节正电压稳压器 3-TO-252 -40 to 125; Supplier Part: C913858; Manufacturer: TI(德州仪器); Supplier Footprint: TO-252-3; Datasheet: https://atta.szlcsc.com/upload/public/pdf/source/20230222/3C897109B3CE6355383F7D8C8FF72961.pdf; Supplier: LCSC
C45 C46 C48 C49 C51 C52 = TAJA106K016RNJ: 容值:10uF;精度:±10%;额定电压:16V;等效串联电阻:3Ω@100kHz;; LCSC Part Name: 10uF ±10% 16V; Supplier Part: C7171; Manufacturer: Kyocera AVX; Supplier Footprint: CASE-A-3216; JLCPCB Part Class: 基础库; Datasheet: https://atta.szlcsc.com/upload/public/pdf/source/20160107/1457707748093.pdf; Supplier: LCSC; Tolerance: ±10%; Rated Voltage: 16V; Equivalent Series Resistance(ESR): 3Ω@100kHz; Operating Temperature: -55℃~+125℃
C53 C54 C75 C76 C80 = CC0603KRX7R9BB103: 容值:10nF;精度:±10%;额定电压:50V;材质(温度系数):X7R;; LCSC Part Name: 10nF ±10% 50V; Supplier Part: C100042; Manufacturer: YAGEO(国巨); Supplier Footprint: 0603; JLCPCB Part Class: 扩展库; Datasheet: https://atta.szlcsc.com/upload/public/pdf/source/20180326/C100042_E8B0111D51DE3671A0A4A59FBCEFE81C.pdf; Supplier: LCSC; Tolerance: ±10%; Voltage Rated: 50V; Temperature Coefficient: X7R
C55 = CC0603JRNPO9BN681: 容值:680pF;精度:±5%;额定电压:50V;材质(温度系数):NP0;; LCSC Part Name: 680pF ±5% 50V; Supplier Part: C107055; Manufacturer: YAGEO(国巨); Supplier Footprint: 0603; JLCPCB Part Class: 扩展库; Datasheet: https://atta.szlcsc.com/upload/public/pdf/source/20170420/1492670698329.pdf; Supplier: LCSC; Tolerance: ±5%; Voltage Rated: 50V; Temperature Coefficient: NP0
C63 C68 = CC0603CRNPO9BN4R7: 容值:4.7pF;额定电压:50V;材质(温度系数):NP0;; LCSC Part Name: 4.7pF 50V ±0.25pF; Supplier Part: C282071; Manufacturer: YAGEO(国巨); Supplier Footprint: 0603; JLCPCB Part Class: 扩展库; Datasheet: https://atta.szlcsc.com/upload/public/pdf/source/20181008/C309499_21CC21451B82C39E3D92150FD6B30293.pdf; Supplier: LCSC; Voltage Rated: 50V; Temperature Coefficient: NP0
C64 C69 = CC0603JRNPO9BN240: 容值:24pF;精度:±5%;额定电压:50V;材质(温度系数):NP0;; LCSC Part Name: 24pF ±5% 50V; Supplier Part: C107044; Manufacturer: YAGEO(国巨); Supplier Footprint: 0603; JLCPCB Part Class: 扩展库; Datasheet: https://atta.szlcsc.com/upload/public/pdf/source/20170420/1492670692047.pdf; Supplier: LCSC; Tolerance: ±5%; Voltage Rated: 50V; Temperature Coefficient: NP0
C65 C70 = CC0603JRNPO9BN330: 容值:33pF;精度:±5%;额定电压:50V;材质(温度系数):NP0;; LCSC Part Name: 33pF ±5% 50V; Supplier Part: C107047; Manufacturer: YAGEO(国巨); Supplier Footprint: 0603; JLCPCB Part Class: 扩展库; Datasheet: https://atta.szlcsc.com/upload/public/pdf/source/20170420/1492670693688.pdf; Supplier: LCSC; Tolerance: ±5%; Voltage Rated: 50V; Temperature Coefficient: NP0
C66 C71 = CC0603JRNPO9BN180: 容值:18pF;精度:±5%;额定电压:50V;材质(温度系数):NP0;; LCSC Part Name: 18pF ±5% 50V; Supplier Part: C107040; Manufacturer: YAGEO(国巨); Supplier Footprint: 0603; JLCPCB Part Class: 扩展库; Datasheet: https://atta.szlcsc.com/upload/public/pdf/source/20170420/1492670689750.pdf; Supplier: LCSC; Tolerance: ±5%; Voltage Rated: 50V; Temperature Coefficient: NP0
L1 = NLCV32T-100K-PF: 电感值:10uH;精度:±10%;额定电流:450mA;饱和电流(Isat):-;直流电阻(DCR):360mΩ;; LCSC Part Name: 10uH ±10% 360mΩ; Supplier Part: C107341; Manufacturer: TDK; Supplier Footprint: 1210; JLCPCB Part Class: 扩展库; Datasheet: https://atta.szlcsc.com/upload/public/pdf/source/20170420/1492670793353.pdf; Supplier: LCSC; Tolerance: ±10%; Rated Current: 450mA; DC Resistance (DCR): 360mΩ; Q @ Freq: 15@2.52MHz; Frequency - Self Resonant: 30MHz
L2 L5 = VHF160808H47NJT: 电感值:47nH;精度:±5%;额定电流:200mA;饱和电流(Isat):-;直流电阻(DCR):1Ω;; LCSC Part Name: 47nH ±5%; Supplier Part: C90210; Manufacturer: FH(风华); Supplier Footprint: 0603; JLCPCB Part Class: 扩展库; Datasheet: https://atta.szlcsc.com/upload/public/pdf/source/20230223/8EF545BE87E825DABED9AF3380ABCE94.pdf; Supplier: LCSC; Tolerance: ±5%; Rated Current: 200mA; DC Resistance (DCR): 1Ω
L3 L6 = FHW0603UC082JST: 直流电阻(DCR):550mΩ;精度:±5%;电感值:82nH;额定电流:400mA;; LCSC Part Name: 82nH ±5%; Supplier Part: C139255; Manufacturer: FH(风华); Supplier Footprint: 0603; JLCPCB Part Class: 扩展库; Datasheet: https://atta.szlcsc.com/upload/public/pdf/source/20171106/C139255_15099442228361091825.pdf; Supplier: LCSC; DC Resistance (DCR): 550mΩ; Tolerance: ±5%; Rated Current: 400mA
L4 L7 = VHF160808H68NJT: 电感值:68nH;精度:±5%;额定电流:200mA;饱和电流(Isat):-;直流电阻(DCR):1Ω;; LCSC Part Name: 68nH ±5%; Supplier Part: C90212; Manufacturer: FH(风华); Supplier Footprint: 0603; JLCPCB Part Class: 扩展库; Datasheet: https://atta.szlcsc.com/upload/public/pdf/source/20230223/8EF545BE87E825DABED9AF3380ABCE94.pdf; Supplier: LCSC; Tolerance: ±5%; Rated Current: 200mA; DC Resistance (DCR): 1Ω
R41 = RC0603FR-071KL: 电阻类型:厚膜电阻;阻值:1kΩ;精度:±1%;功率:100mW;; LCSC Part Name: 1kΩ ±1% 100mW; Supplier Part: C22548; Manufacturer: YAGEO(国巨); Supplier Footprint: 0603; JLCPCB Part Class: 扩展库; Datasheet: https://atta.szlcsc.com/upload/public/pdf/source/20180312/7BD3618A8B6324EA6280B0497A051AB7.pdf; Supplier: LCSC; Type: 厚膜电阻; Tolerance: ±1%; Power(Watts): 100mW; Temperature Coefficient: ±100ppm/℃; Overload Voltage (Max): 75V; Operating Temperature Range: -55℃~+155℃
R23-R25 R28 R29 R32 R42 R43 = 0603WAF0000T5E: 电阻类型:厚膜电阻;阻值:0Ω;精度:±1%;功率:100mW;; LCSC Part Name: 0Ω ±1% 100mW; Supplier Part: C21189; Manufacturer: UNI-ROYAL(厚声); Supplier Footprint: 0603; JLCPCB Part Class: 基础库; Datasheet: https://atta.szlcsc.com/upload/public/pdf/source/20200306/C422600_1E6D84923E4A46A82E41ADD87F860B5C.pdf; Supplier: LCSC; Type: 厚膜电阻; Tolerance: ±1%; Power(Watts): 100mW; Overload Voltage (Max): 75V; Operating Temperature Range: -55℃~+155℃
R44 = 0603WAF1801T5E: 电阻类型:厚膜电阻;阻值:1.8kΩ;精度:±1%;功率:100mW;; LCSC Part Name: 1.8kΩ ±1% 100mW; Supplier Part: C4177; Manufacturer: UNI-ROYAL(厚声); Supplier Footprint: 0603; JLCPCB Part Class: 基础库; Datasheet: https://atta.szlcsc.com/upload/public/pdf/source/20200306/C422600_1E6D84923E4A46A82E41ADD87F860B5C.pdf; Supplier: LCSC; Type: 厚膜电阻; Tolerance: ±1%; Power(Watts): 100mW; Temperature Coefficient: ±100ppm/℃; Overload Voltage (Max): 75V; Operating Temperature Range: -55℃~+155℃
R1-R6 R45-R57 R62-R67 = 0603WAF1000T5E: 电阻类型:厚膜电阻;阻值:100Ω;精度:±1%;功率:100mW;; LCSC Part Name: 100Ω ±1% 100mW; Supplier Part: C22775; Manufacturer: UNI-ROYAL(厚声); Supplier Footprint: 0603; JLCPCB Part Class: 基础库; Datasheet: https://atta.szlcsc.com/upload/public/pdf/source/20200306/C422600_1E6D84923E4A46A82E41ADD87F860B5C.pdf; Supplier: LCSC; Type: 厚膜电阻; Tolerance: ±1%; Power(Watts): 100mW; Temperature Coefficient: ±200ppm/℃; Overload Voltage (Max): 75V; Operating Temperature Range: -55℃~+155℃
R11 R12 R21 R22 R58 R59 = 0603WAF499JT5E: 电阻类型:厚膜电阻;阻值:49.9Ω;精度:±1%;功率:100mW;; LCSC Part Name: 49.9Ω ±1% 100mW; Supplier Part: C23185; Manufacturer: UNI-ROYAL(厚声); Supplier Footprint: 0603; Datasheet: https://atta.szlcsc.com/upload/public/pdf/source/20200306/C422600_1E6D84923E4A46A82E41ADD87F860B5C.pdf; Supplier: LCSC; Type: 厚膜电阻; Tolerance: ±1%; Power(Watts): 100mW; Temperature Coefficient: ±100ppm/℃; Overload Voltage (Max): 75V; Operating Temperature Range: -55℃~+155℃
U11 = AD9959BCPZ-REEL7: 自宽调谐(最大值):-;; Supplier Part: C653947; Manufacturer: ADI(亚德诺)/LINEAR(凌特); Supplier Footprint: LFCSP-56; JLCPCB Part Class: 扩展库; Datasheet: https://atta.szlcsc.com/upload/public/pdf/source/20210202/C653947_7CD8CAFC6A74E33F0357D94B37A44C99.pdf; Supplier: LCSC
U12 U15 = AMS1117-3.3_C347222: 输出类型:固定;输出极性:正;最大输入电压:18V;输出电压:3.3V;输出电流:1A;电源纹波抑制比(PSRR):60dB@(120Hz);; Supplier Part: C347222; Manufacturer: UMW(广东友台半导体); Supplier Footprint: SOT-223; JLCPCB Part Class: 扩展库; Datasheet: https://atta.szlcsc.com/upload/public/pdf/source/20211011/50CC665C22E3A66C08379A4A74BDA25C.pdf; Supplier: LCSC; Output Type: 固定; Output Polarity: 正; Number of Outputs: 1; Maximum Input Voltage: 18V; Output Voltage: 3.3V; Dropout Voltage: 1.3V@(1A); Output Current: 1A; Power Supply Rejection Ratio (PSRR): 60dB@(120Hz)
U14 = AMS1117-1.8_C347220: 输出类型:固定;输出极性:正;最大输入电压:18V;输出电压:1.8V;输出电流:1A;电源纹波抑制比(PSRR):60dB@(120Hz);; LCSC Part Name: 输入18V 输出1.8V 1A; Supplier Part: C347220; Manufacturer: UMW(友台半导体); Supplier Footprint: SOT-223; JLCPCB Part Class: 扩展库; Datasheet: https://atta.szlcsc.com/upload/public/pdf/source/20211011/50CC665C22E3A66C08379A4A74BDA25C.pdf; Supplier: LCSC; Output Type: 固定; Output Polarity: 正; Number of Outputs: 1; Maximum Input Voltage: 18V; Output Voltage: 1.8V; Dropout Voltage: 1.3V@(1A); Output Current: 1A; Power Supply Rejection Ratio (PSRR): 60dB@(120Hz)
X1 = OT322525MJBA4SL: 频率:25MHz;频率稳定度:±10ppm;工作电压:1.8V~3.3V;; LCSC Part Name: 25MHz ±10ppm 1.8V~3.3V YSO110TR; Supplier Part: C669088; Manufacturer: YXC(扬兴晶振); Supplier Footprint: SMD3225-4P; JLCPCB Part Class: 扩展库; Datasheet: https://atta.szlcsc.com/upload/public/pdf/source/20210329/C669065_30B18CFE780D377BA4E84F6ED1951959.pdf; Supplier: LCSC; Frequency Stability: ±10ppm; Supply Voltage: 1.8V~3.3V; Supply Current (Max): 5mA; Operating Temperature: -40℃~+85℃
R7-R10 R68 R70 = RC0603FR-0710KL: 电阻类型:厚膜电阻;阻值:10kΩ;精度:±1%;功率:100mW;; LCSC Part Name: 10kΩ ±1% 100mW; Supplier Part: C98220; Manufacturer: YAGEO(国巨); Supplier Footprint: 0603; Datasheet: https://atta.szlcsc.com/upload/public/pdf/source/20170522/1495423494387.pdf; Supplier: LCSC; Type: 厚膜电阻; Tolerance: ±1%; Power(Watts): 100mW; Temperature Coefficient: ±100ppm/℃; Overload Voltage (Max): 75V; Operating Temperature Range: -55℃~+155℃
RF1 = BWSMA-KE-P001: 连接器类型:板端;射频系列:SMA;接口类型:内孔;端口数量:1;阻抗:50Ω;频率-最大值:12.4GHz;样式:偏脚;接口直径:5.2mm;接口长度/高度:-;工作温度范围:-;; LCSC Part Name: SMA 内孔 偏脚 SMA偏脚板端座子; Supplier Part: C496550; Manufacturer: BAT WIRELESS(蝙蝠无线); Supplier Footprint: 插件; Datasheet: https://atta.szlcsc.com/upload/public/pdf/source/20200416/C496550_06668BF2E3B968EA39F96D17E7156373.pdf; Supplier: LCSC; Connector Type: 板端; RF Series: SMA; Interface Type: 内孔; Number of Ports: 1; Impedance: 50Ω; Frequency-Max: 12.4GHz; Style: 偏脚; Interface Diameter: 5.2mm
U1 U2 = THS4011IDG4: 290MHz 低失真电压反馈放大器 8-SOIC -40 to 85; Supplier Part: C1348347; Manufacturer: TI(德州仪器); Supplier Footprint: SOIC-8; JLCPCB Part Class: 扩展库; Datasheet: https://www.ti.com/cn/lit/gpn/ths4012; Supplier: LCSC
C14 C18 = CC0603KRX7R9BB222: 容值:2.2nF;精度:±10%;额定电压:50V;材质(温度系数):X7R;; LCSC Part Name: 2.2nF ±10% 50V; Supplier Part: C107082; Manufacturer: YAGEO(国巨); Supplier Footprint: 0603; JLCPCB Part Class: 扩展库; Datasheet: https://atta.szlcsc.com/upload/public/pdf/source/20170420/1492670716015.pdf; Supplier: LCSC; Tolerance: ±10%; Voltage Rated: 50V; Temperature Coefficient: X7R
R15-R18 R72-R75 = RC0603FR-072KL: 阻值:2kΩ;精度:±1%;功率:100mW;温度系数:±100ppm/℃;最大工作电压:75V;工作温度范围:-55℃~+155℃;; LCSC Part Name: 2kΩ ±1% 100mW; Supplier Part: C105576; Manufacturer: YAGEO(国巨); Supplier Footprint: 0603; JLCPCB Part Class: 扩展库; Datasheet: https://atta.szlcsc.com/upload/public/pdf/source/20170428/1493376739276.pdf; Supplier: LCSC; Tolerance: ±1%; Power(Watts): 100mW; Temperature Coefficient: ±100ppm/℃; Overload Voltage (Max): 75V; Operating Temperature Range: -55℃~+155℃
R26 R30 = 0603WAF2701T5E: 电阻类型:厚膜电阻;阻值:2.7kΩ;精度:±1%;功率:100mW;; LCSC Part Name: 2.7kΩ ±1% 100mW; Supplier Part: C13167; Manufacturer: UNI-ROYAL(厚声); Supplier Footprint: 0603; JLCPCB Part Class: 基础库; Datasheet: https://atta.szlcsc.com/upload/public/pdf/source/20200306/C422600_1E6D84923E4A46A82E41ADD87F860B5C.pdf; Supplier: LCSC; Type: 厚膜电阻; Tolerance: ±1%; Power(Watts): 100mW; Temperature Coefficient: ±100ppm/℃; Overload Voltage (Max): 75V; Operating Temperature Range: -55℃~+155℃
R27 R31 = RC0603FR-074K7L: 电阻类型:厚膜电阻;阻值:4.7kΩ;精度:±1%;功率:100mW;; LCSC Part Name: 4.7kΩ ±1% 100mW; Supplier Part: C99782; Manufacturer: YAGEO(国巨); Supplier Footprint: 0603; JLCPCB Part Class: 扩展库; Datasheet: https://atta.szlcsc.com/upload/public/pdf/source/20171030/C99782_15093665213961068236.pdf; Supplier: LCSC; Type: 厚膜电阻; Tolerance: ±1%; Power(Watts): 100mW; Temperature Coefficient: ±100ppm/℃; Overload Voltage (Max): 75V; Operating Temperature Range: -55℃~+155℃
U3 U4 = AD835ARZ: 250MHz，电压输出，四象限乘法器; Supplier Part: C26332; Manufacturer: ADI(亚德诺); Supplier Footprint: SOIC-8; Datasheet: https://atta.szlcsc.com/upload/public/pdf/source/20140314/1457707016009.pdf; Supplier: LCSC
U5 U6 = OPA227UA: 放大器组数:-;; Supplier Part: C962975; Manufacturer: TI(德州仪器); Supplier Footprint: SOIC-8; JLCPCB Part Class: 扩展库; Datasheet: https://www.ti.com/cn/lit/gpn/opa4228; Supplier: LCSC
C79 C83 = KNE2220UF25V149EC0030: 容值:220uF;精度:±20%;额定电压:25V;纹波电流:3.1A@100kHz;等效串联电阻:18mΩ@100kHz;; LCSC Part Name: 220uF ±20% 25V; Supplier Part: C2943986; Manufacturer: KNSCHA(科尼盛); Supplier Footprint: 插件,6.3x8mm; JLCPCB Part Class: 扩展库; Datasheet: https://atta.szlcsc.com/upload/public/pdf/source/20220426/6D36ABCEAFF08C1F9183CDC059524FCA.pdf; Supplier: LCSC; Tolerance: ±20%; Rated Voltage: 25V; φD: 6.3mm; L: 8mm; Lead Spacing: 2.5mm; Ripple Current: 3.1A@100kHz; Equivalent Series Resistance(ESR): 18mΩ@100kHz; Lifetime @ Temp: 2000hrs@105℃; Operating Temperature: -55℃~+105℃
D1 D2 = SS54_C727065: 二极管配置:独立式;直流反向耐压(Vr):40V;平均整流电流(Io):5A;正向压降(Vf):550mV@5A;反向电流(Ir):500uA@40V;; LCSC Part Name: 40V 5A 550mV@5A; Supplier Part: C727065; Manufacturer: TWGMC(台湾迪嘉); Supplier Footprint: SMA; JLCPCB Part Class: 扩展库; Datasheet: https://atta.szlcsc.com/upload/public/pdf/source/20200828/C727064_BD0A2B36CBC76CEA4B6710C57718D41F.pdf; Supplier: LCSC; Diode Configuration: 独立式; Reverse Voltage (Vr): 40V; Average Rectified Current (Io): 5A; Forward Voltage (Vf@If): 550mV@5A; Reverse Leakage Current (Ir): 500uA@40V
FPC3 = AFA01-S10FCA-00: 间距:1mm;触点数量:10;锁定特性:翻盖式;安装类型:卧贴;触点类型:下接;; LCSC Part Name: FPC 1.0MM 10P 翻盖式 H2.0mm 下接; Supplier Part: C262756; Manufacturer: JS(钜硕电子); Supplier Footprint: P=1mm; JLCPCB Part Class: 扩展库; Supplier: LCSC; Pitch: 1mm; Number of Contacts: 10; Locking Feature: 翻盖式; Mounting Type: 卧贴; Contact Type: 下接; Height Above Board: 2mm; FFC, FCB Thickness: 0.3mm~0.3mm
L8 L9 = SLO0650H220MTT: 电感值:22uH;精度:±20%;额定电流:2.6A;; LCSC Part Name: 22uH ±20% 2.6A 110mΩ; Supplier Part: C397792; Manufacturer: Sunltech(韩国顺磁); Supplier Footprint: SMD,6.6x7.1mm; JLCPCB Part Class: 扩展库; Datasheet: https://atta.szlcsc.com/upload/public/pdf/source/20190614/C397792_2DC3229385DA61EA5C1E130017AE291C.pdf; Supplier: LCSC; Tolerance: ±20%; Rated Current: 2.6A; DC Resistance (DCR): 110mΩ
P1 = WJ126V-5.0-2P: 间距:5mm;结构:1x2P;排数:1;每排PIN数:2;安装方式:直针;额定电流:18A;额定电压:250V;线规 - AWG:14~26;线规 - mm2:2.5;工作温度范围:-40℃~+105℃;颜色:绿色;; LCSC Part Name: 5mm 1x2P 排数:1 每排P数:2 直针 可拼接; Supplier Part: C8404; Manufacturer: KANGNEX(康奈克斯电气); Supplier Footprint: 插件,P=5mm; JLCPCB Part Class: 扩展库; Datasheet: https://atta.szlcsc.com/upload/public/pdf/source/20191225/C8404_8F52D87DF851D149A4DEA9BD9FA83F9A.pdf; Supplier: LCSC; Pitch: 5mm; Structure: 1x2P; Number of Rows: 1; Number of PINs Per Row: 2; Mounting Style: 直针; Current Rating (Max): 18A; Voltage Rating (Max): 250V; Wire Gauge - AWG: 14~26; Wire Gauge - mm2: 2.5; Operating Temperature Range: -40℃~+105℃; Color: 绿色
R69 R71 = 0603WAF3241T5E: 电阻类型:厚膜电阻;阻值:3.24kΩ;精度:±1%;功率:100mW;; LCSC Part Name: 3.24kΩ ±1% 100mW; Supplier Part: C22994; Manufacturer: UNI-ROYAL(厚声); Supplier Footprint: 0603; JLCPCB Part Class: 扩展库; Datasheet: https://atta.szlcsc.com/upload/public/pdf/source/20200306/C422600_1E6D84923E4A46A82E41ADD87F860B5C.pdf; Supplier: LCSC; Type: 厚膜电阻; Tolerance: ±1%; Power(Watts): 100mW; Temperature Coefficient: ±100ppm/℃; Overload Voltage (Max): 75V; Operating Temperature Range: -55℃~+155℃
U16 U17 = TPS5430DDAR: 功能类型:降压型;同步整流:-;输出通道数:-;拓扑结构:-;输入电压:-;输出电流(最大值):-;开关频率:-;; LCSC Part Name: 降压型; Supplier Part: C9864; Manufacturer: TI(德州仪器); Supplier Footprint: SO-8; JLCPCB Part Class: 基础库; Datasheet: https://atta.szlcsc.com/upload/public/pdf/source/20161207/1481104217724.pdf; Supplier: LCSC; Function: 降压型

## Nets
+2.5V: C23.2 C40.2 C41.2 R38.2 U7.9(AVDD) U10.2(OUTPUT)
+3.3V: C27.2 C28.1 C29.2 C32.2 U7.15(IOVDD) U7.16(RESV) U7.17(RESET#) U7.29(IOVDD) U7.30(M0) U7.31(M1) U8.3(VOUT)
+5V: C78.2 C79.1 FPC3.1 FPC3.2 FPC3.3 FPC3.4 FPC3.5 H1.1 H2.1 H3.1 H4.1 L8.2 R68.2
+5V_A: C2.1 C4.2 C5.2 H1.3 U1.7(VCC+) U2.7(VCC+)
+5V_B: C7.2 C9.1 C11.1 C15.1 C19.1 H2.3 U3.6(VP) U4.6(VP) U5.7(V+) U6.7(V+)
+5V_C: C30.2 C31.2 C33.2 C37.2 C38.2 H3.3 U8.2(VIN) U10.3(INPUT)
+5V_D: C43.2 C46.1 C47.2 C49.1 C50.2 H4.3 U12.3(VIN) U15.3(VIN)
+6V: C77.2 C81.2 P1.1 U16.7(VIN) U17.7(VIN)
+A1.8V: C51.1 C56.2 C57.2 C58.2 C59.2 C60.2 C61.2 C84.2 C85.2 C86.2 L1.1 R42.2 R58.1 R59.1 R62.1 R63.1 R64.1 R65.1 R66.1 R67.1 U11.5(AVDD) U11.7(AVDD) U11.11(AVDD) U11.15(AVDD) U11.19(AVDD) U11.21(AVDD) U11.26(AVDD) U11.31(AVDD) U11.33(AVDD) U11.37(AVDD) U11.39(AVDD) U14.2(VOUT(TAB))
+D1.8V: C52.1 C73.2 C74.2 C75.2 L1.2 U11.45(DVDD) U11.55(DVDD) X1.4(VDD)
+D3.3V: C45.1 C62.2 U11.49(DVDD_IO) U12.2(VOUT(TAB))
-2.5V: C23.1 C24.1 C25.1 C36.2 C39.2 R37.2 U7.10(AVSS) U7.11(VNCP) U7.13(REFN) U9.3(OUTPUT)
-5V: C81.1 C82.1 C83.2 D2.2 H1.2 H2.2 H3.2 H4.2 R71.1 U17.6(GND) U17.9(PowerPAD)
-5V_A: C1.2 C3.2 C6.2 H1.4 U1.4(VCC-) U2.4(VCC-)
-5V_B: C8.2 C10.1 C12.1 C16.1 C20.1 H2.4 U3.3(VN) U4.3(VN) U5.4(V-) U6.4(V-)
-5V_C: C34.2 C35.2 C42.2 H3.4 U9.2(INPUT)
-5V_D: C44.2 H4.4
GND: C1.1 C2.2 C3.1 C4.1 C5.1 C6.1 C7.1 C8.1 C9.2 C10.2 C11.2 C12.2 C13.1 C15.2 C16.2 C17.1 C19.2 C20.2 C26.1 C27.1 C28.2 C29.1 C30.1 C31.1 C32.1 C33.1 C34.1 C35.1 C36.1 C37.1 C38.1 C39.1 C40.1 C41.1 C42.1 C43.1 C44.1 C45.2 C46.2 C47.1 C48.2 C49.2 C50.1 C51.2 C52.2 C53.1 C55.1 C56.1 C57.1 C58.1 C59.1 C60.1 C61.1 C62.1 C63.1 C64.1 C65.1 C66.1 C68.1 C69.1 C70.1 C71.1 C73.1 C74.1 C75.1 C77.1 C78.1 C79.2 C82.2 C83.1 C84.1 C85.1 C86.1 D1.2 FPC1.1 FPC1.3 FPC1.5 FPC1.7 FPC1.8 FPC1.10 FPC1.12 FPC1.14 FPC1.15 FPC1.16 FPC2.14 FPC2.15 FPC2.16 FPC3.6 FPC3.7 FPC3.8 FPC3.9 FPC3.10 FPC3.11 FPC3.12 L9.2 P1.2 R5.1 R6.1 R8.1 R16.1 R18.1 R33.1 R35.1 R39.1 R40.1 R43.1 R44.1 R69.1 R70.2 R72.2 R73.1 R74.1 R75.2 RF1.1 RF1.2 RF1.3 RF1.4 U3.2(Y2) U3.7(X2) U4.2(Y2) U4.7(X2) U7.27(GND) U7.32(M2) U8.1(GND) U11.6(AGND) U11.10(AGND) U11.12(AGND) U11.16(AGND) U11.18(AGND) U11.20(AGND) U11.25(AGND) U11.28(AGND) U11.32(AGND) U11.34(AGND) U11.38(AGND) U11.44(DGND) U11.56(DGND) U11.57(EP) U12.1(ADJ(GND)) U14.1(ADJ(GND)) U15.1(ADJ(GND)) U16.6(GND) U16.9(PowerPAD) X1.2(GND)
#CH0: R66.2 U11.29(CH0_IOUT#)
#CH1: R67.2 U11.35(CH1_IOUT#)
#CH2: R63.2 U11.9(CH2_IOUT#)
#CH3: R65.2 U11.14(CH3_IOUT#)
#CS: R50.2 U11.47(CS#)
#DRDY_ADC: FPC1.13 U7.19(DRDY#)
CH0: C68.2 L5.1 R58.2 U11.30(CH0_IOUT)
CH1: C63.2 L2.1 R59.2 U11.36(CH1_IOUT)
CH2: R62.2 U11.8(CH2_IOUT)
CH3: R64.2 U11.13(CH3_IOUT)
CLK_25M: C54.1 X1.3(OUT)
CLK_ADC: FPC1.2 U7.25(XTAL1/CLKIN)
CLK_MODE_SEL: R42.1 R43.2 U11.24(CLK_MODE_SEL)
DOWNCONVERSION_OF_INCIDENT: C14.2 R28.2 R36.1 U5.6(OUT)
DOWNCONVERSION_OF_REFLECTED: C18.2 R32.2 R34.1 U6.6(OUT)
INCIDENT_SIGNAL: R11.1 R24.1
IO_UPDATE: R49.2 U11.46(IO/_UPDATE)
MISO_ADC: FPC1.9 U7.21(DOUT)
MOSI_ADC: FPC1.11 U7.20(DIN)
NSS_ADC: FPC1.4 U7.23(CS#)
P0: R45.2 U11.40(P0)
P1: R46.2 U11.41(P1)
P2: R47.2 U11.42(P2)
P3: R48.2 U11.43(P3)
PDC: R57.2 U11.4(PWR_DWN_CTL)
REFERENCE_SIGNAL: C67.1 R21.2 R22.2
REFLECTED_SIGNAL: R12.1 R23.1
REST: R56.2 U11.3(MASTER_RESET)
SCK_ADC: FPC1.6 U7.22(SCLK)
SCLK: R51.2 U11.48(SCLK)
SDIO_0: R52.2 U11.50(SDOI_0)
SDIO_1: R53.2 U11.51(SDOI_1)
SDIO_2: R54.2 U11.52(SDOI_2)
SDIO_3: R55.2 U11.53(SDOI_3)
SWEEP_SIGNAL: C72.1 R1.2 R2.2 R3.2 R4.2
$1N1628: R11.2 U2.2(IN-) U2.6(OUT)
$1N1718: R7.1 R8.2 U1.3(IN+)
$1N1724: R9.2 R10.1 U1.2(IN-)
$1N1731: R10.2 R12.2 U1.6(OUT)
$1N1740: R1.1 R2.1 R7.2 RF1.5
$1N1761: R3.1 R4.1 R5.2 R6.2 R9.1 U2.3(IN+)
$2N800: R17.1 R18.2 U3.4(Z)
$2N820: R15.1 R16.2 U4.4(Z)
$2N1363: R21.1 R73.2 U3.8(X1)
$2N1368: R24.2 R72.1 U3.1(Y1)
$2N1373: R22.1 R74.2 U4.8(X1)
$2N1573: R23.2 R75.1 U4.1(Y1)
$2N2385: R28.1 U5.2(-IN)
$2N2408: C14.1 R26.2 R27.1
$2N2437: R25.2 R26.1
$2N2441: C13.2 R27.2 U5.3(+IN)
$2N2451: R17.2 R25.1 U3.5(W)
$2N2851: R32.1 U6.2(-IN)
$2N2861: C18.1 R30.2 R31.1
$2N2866: R29.2 R30.1
$2N2868: C17.2 R31.2 U6.3(+IN)
$2N2878: R15.2 R29.1 U4.5(W)
$3N592: C21.1 R34.2 U7.2(AIN1P)
$3N598: C21.2 R33.2 U7.1(AIN1N)
$3N604: C22.2 R35.2 U7.3(AIN2N)
$3N610: C22.1 R36.2 U7.4(AIN2P)
$3N943: C24.2 U7.12(REFP)
$3N947: C25.2 U7.14(REFEXT)
$3N1175: C26.2 U7.28(CAP)
$3N3214: R38.1 R39.2 U10.1(ADJUST)
$3N3391: R37.1 R40.2 U9.1(ADJ)
$4N1784: C48.1 U14.3(VIN) U15.2(VOUT(TAB))
$4N2598: C53.2 U11.22(REF_CLK#)
$4N2603: C54.2 U11.23(REF_CLK)
$4N2750: C55.2 R41.1
$4N2803: R41.2 U11.27(LOOP_FILTER)
$4N3007: R44.2 U11.17(DAC_RSET)
$4N3721: FPC2.1 R57.1
$4N3724: FPC2.2 R56.1
$4N3727: FPC2.3 R55.1
$4N3730: FPC2.4 R54.1
$4N3733: FPC2.5 R53.1
$4N3736: FPC2.6 R52.1
$4N3739: FPC2.7 R51.1
$4N3742: FPC2.8 R50.1
$4N3745: FPC2.9 R49.1
$4N3748: FPC2.10 R48.1
$4N3751: FPC2.11 R47.1
$4N3754: FPC2.12 R46.1
$4N3757: FPC2.13 R45.1
$4N4799: C64.2 L2.2 L3.1
$4N4809: C65.2 L3.2 L4.1
$4N4823: C66.2 C67.2 L4.2
$4N5248: C69.2 L5.2 L6.1
$4N5252: C70.2 L6.2 L7.1
$4N5256: C71.2 C72.2 L7.2
$5N417: C76.2 D1.1 L8.1 U16.8(PH)
$5N430: C76.1 U16.1(BOOT)
$5N915: R68.1 R69.2 U16.4(VSENSE)
$5N1396: C80.2 D2.1 L9.1 U17.8(PH)
$5N1404: C80.1 U17.1(BOOT)
$5N1429: R70.1 R71.2 U17.4(VSENSE)

Not connected (* = marked no-connect by the designer): U1 1(NULL) 5(NC) 8(NULL); U2 1(NULL) 5(NC) 8(NULL); U5 1(Trim) 5(NC) 8(Trim); U6 1(Trim) 5(NC) 8(Trim); U7 5(AIN3N) 6(AIN3P) 7(AIN4N) 8(AIN4P) 18(DONE#) 24(NC) 26(XTAL2); U11 1(SYNC_IN)* 2(SYNC_OUT)* 54(SYNC_CLK)*; U12 4(TAB); U14 4(TAB); U15 4(TAB); U16 2(NC) 3(NC) 5(ENA); U17 2(NC) 3(NC) 5(ENA); X1 1(Enable/Disable)
